# Altium project PowerBoard.PrjPcb (part 1 of 2)
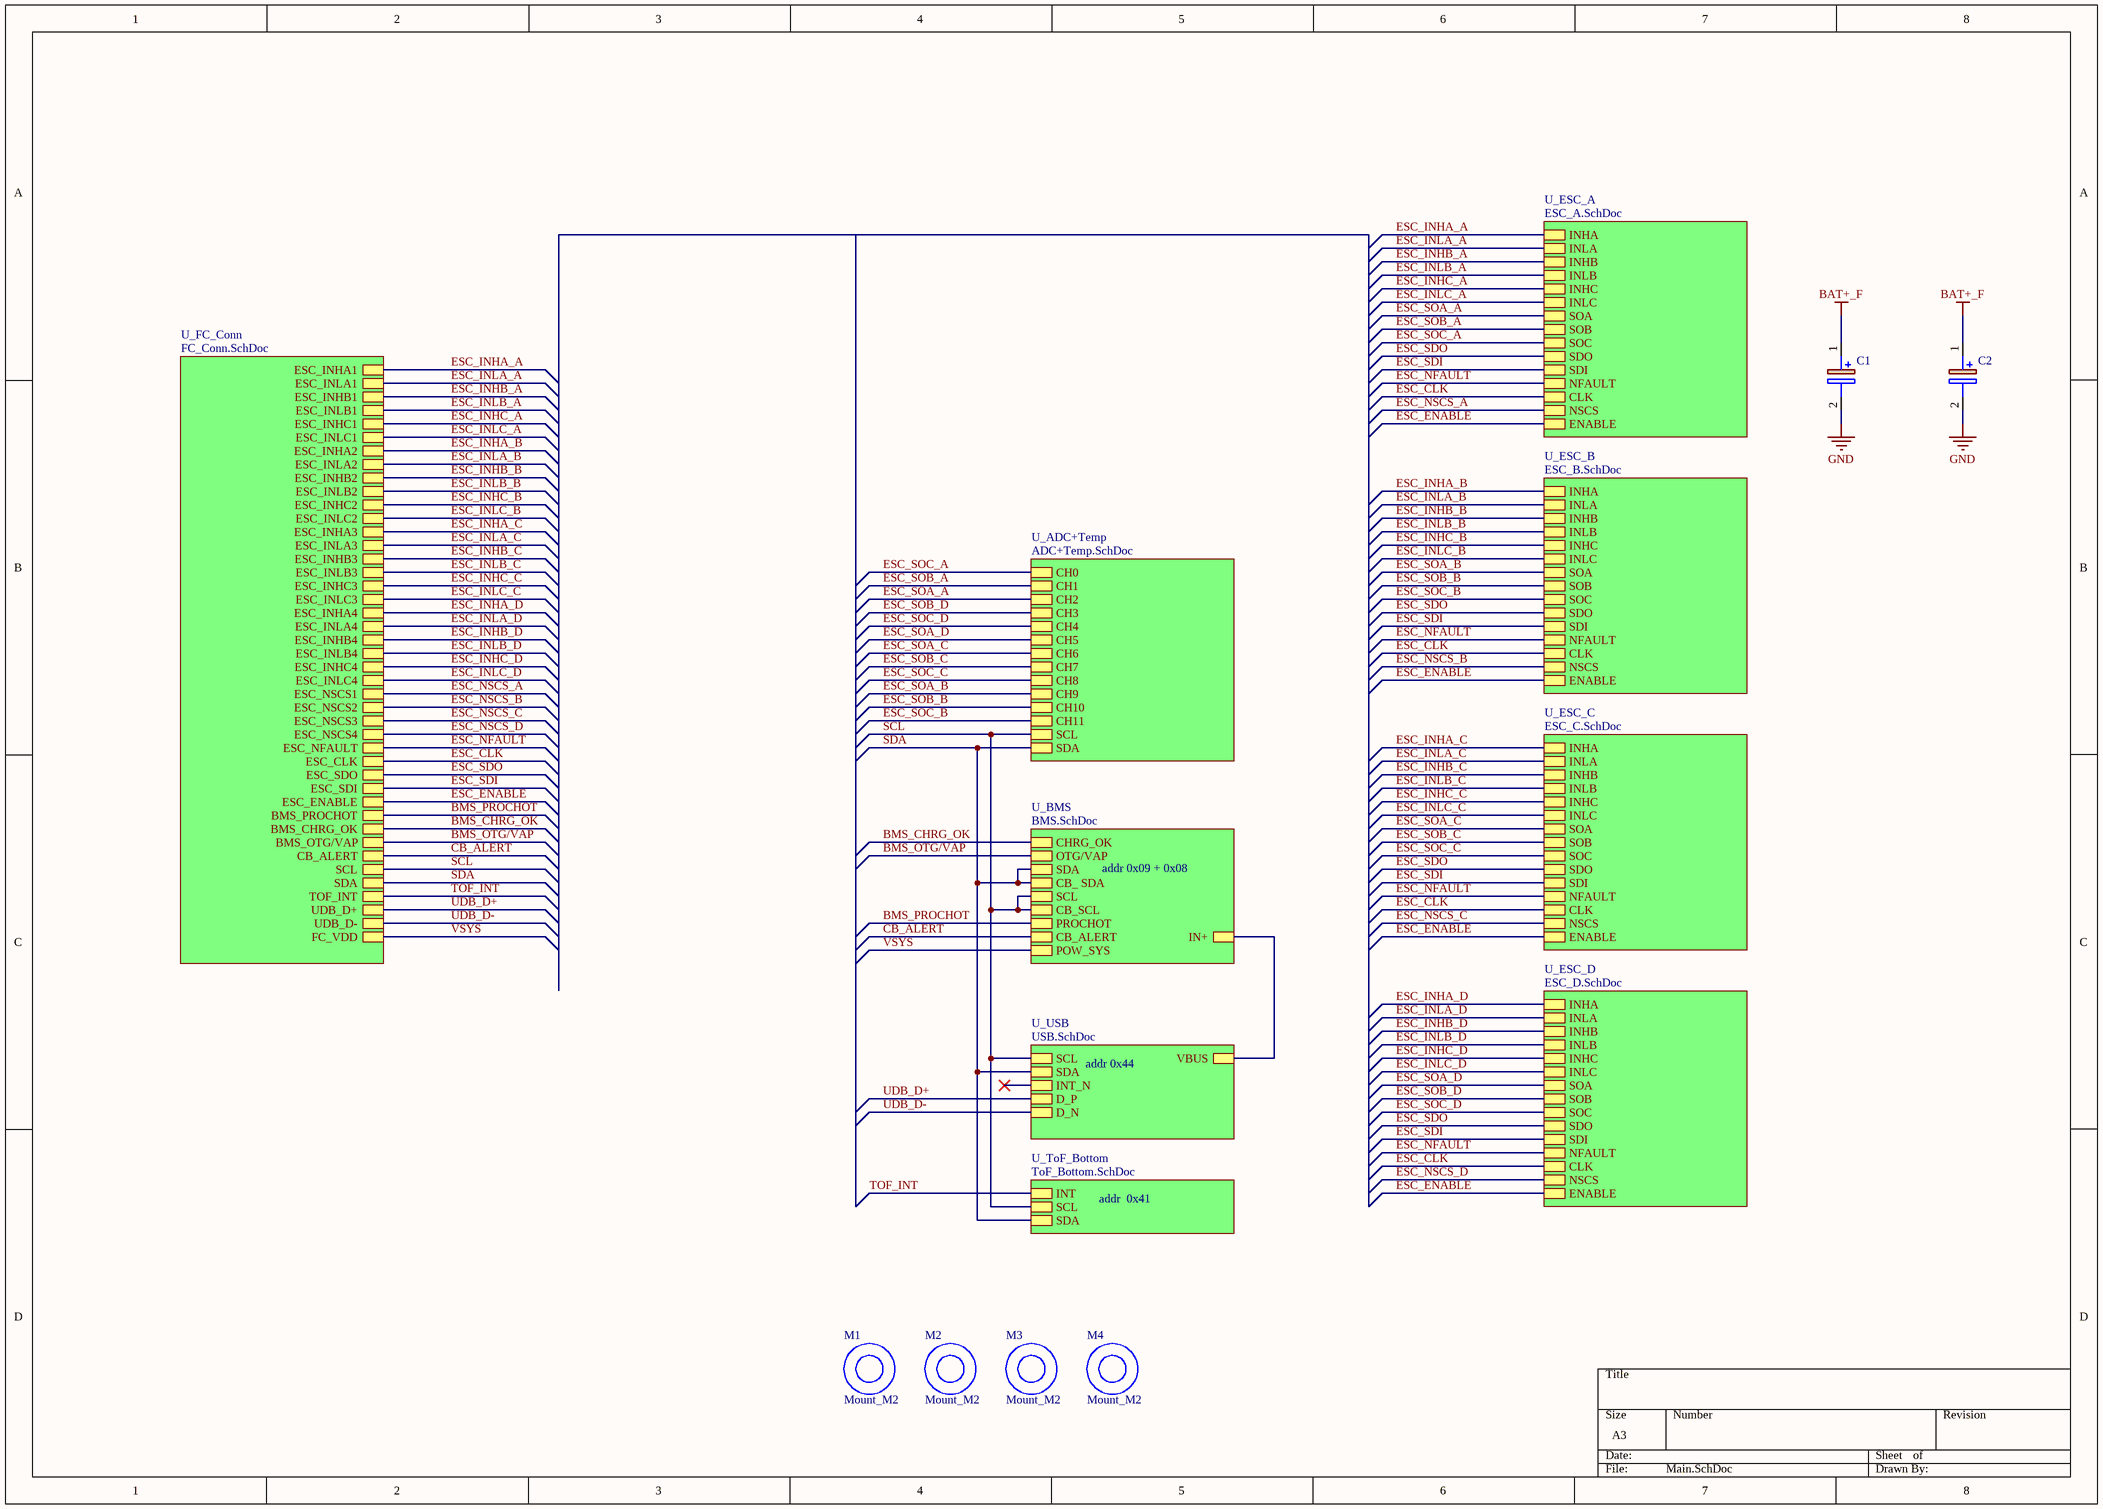
[diagram p0: Main.SchDoc]
10 sheets, 283 parts. Net scope: hierarchical (ports join the sheet entries above them; power ports are global).
Board file: PCB.PcbDoc
Sheets:
  Main.SchDoc
    U_BMS = BMS.SchDoc
    U_USB = USB.SchDoc
    U_ADC+Temp = ADC+Temp.SchDoc
    U_ToF_Bottom = ToF_Bottom.SchDoc
    U_FC_Conn = FC_Conn.SchDoc
    U_ESC_A = ESC_A.SchDoc
    U_ESC_B = ESC_B.SchDoc
    U_ESC_C = ESC_C.SchDoc
    U_ESC_D = ESC_D.SchDoc

## Sheet Main.SchDoc
size A3; SheetNumber: 1; SheetTotal: 10

### Parts
C1  EEH-ZL1V151XP  [EEEHP1H4R7P]  (value not drawn)
C2  EEH-ZL1V151XP  [EEEHP1H4R7P]  (value not drawn)
M1  Mount_M2  [Mount_M2_anti_vibration_rubber]
M2  Mount_M2  [Mount_M2_anti_vibration_rubber]
M3  Mount_M2  [Mount_M2_anti_vibration_rubber]
M4  Mount_M2  [Mount_M2_anti_vibration_rubber]

### Sub-sheets
U_ADC+Temp = ADC+Temp.SchDoc: SDA, SCL, CH0, CH1, CH2, CH3, CH4, CH5, CH6, CH7, CH8, CH9, CH10, CH11
U_BMS = BMS.SchDoc: CHRG_OK, OTG/VAP, SDA, SCL, PROCHOT, CB_SCL, CB_ SDA, CB_ALERT, POW_SYS, IN+
U_ESC_A = ESC_A.SchDoc: INHA, INLA, INHB, INLB, INHC, INLC, SOA, SOB, SOC, SDO, SDI, NFAULT, CLK, NSCS, ENABLE
U_ESC_B = ESC_B.SchDoc: INHA, INLA, INHB, INLB, INHC, INLC, SOA, SOB, SOC, SDO, SDI, NFAULT, CLK, NSCS, ENABLE
U_ESC_C = ESC_C.SchDoc: INHA, INLA, INHB, INLB, INHC, INLC, SOA, SOB, SOC, SDO, SDI, NFAULT, CLK, NSCS, ENABLE
U_ESC_D = ESC_D.SchDoc: INHA, INLA, INHB, INLB, INHC, INLC, SOA, SOB, SOC, SDO, SDI, NFAULT, CLK, NSCS, ENABLE
U_FC_Conn = FC_Conn.SchDoc: ESC_INLA1, ESC_INLB1, ESC_INLC1, ESC_INLA2, ESC_INLB2, ESC_INLC2, ESC_INLA3, ESC_INLB3, ESC_INLC3, ESC_INHA4, ESC_INLB4, ESC_INLC4, ESC_NSCS1, ESC_INHA1, ESC_INHB1, ESC_INHC1, ESC_INHA2, ESC_INHB2, ESC_INHC2, ESC_INHA3, ESC_INHB3, ESC_INHC3, ESC_INLA4, ESC_INHB4, ESC_INHC4, ESC_NSCS2, ESC_NSCS3, ESC_NSCS4, ESC_NFAULT, ESC_CLK, ESC_SDO, ESC_SDI, ESC_ENABLE, BMS_PROCHOT, BMS_CHRG_OK, BMS_OTG/VAP, CB_ALERT, SCL, SDA, TOF_INT, UDB_D+, UDB_D-, FC_VDD
U_ToF_Bottom = ToF_Bottom.SchDoc: INT, SCL, SDA
U_USB = USB.SchDoc: SCL, SDA, INT_N, D_P, D_N, VBUS

### Nets
BAT+_F: C1.1(+) C2.1(+)
GND: C1.2(-) C2.2(-)
BMS_CHRG_OK: sheet U_BMS/CHRG_OK, sheet U_FC_Conn/BMS_CHRG_OK
BMS_OTG/VAP: sheet U_BMS/OTG/VAP, sheet U_FC_Conn/BMS_OTG/VAP
BMS_PROCHOT: sheet U_BMS/PROCHOT, sheet U_FC_Conn/BMS_PROCHOT
CB_ALERT: sheet U_BMS/CB_ALERT, sheet U_FC_Conn/CB_ALERT
ESC_CLK: sheet U_FC_Conn/ESC_CLK, sheet U_ESC_A/CLK, sheet U_ESC_B/CLK, sheet U_ESC_C/CLK, sheet U_ESC_D/CLK
ESC_ENABLE: sheet U_FC_Conn/ESC_ENABLE, sheet U_ESC_A/ENABLE, sheet U_ESC_B/ENABLE, sheet U_ESC_C/ENABLE, sheet U_ESC_D/ENABLE
ESC_INHA_A: sheet U_FC_Conn/ESC_INHA1, sheet U_ESC_A/INHA
ESC_INHA_B: sheet U_FC_Conn/ESC_INHA2, sheet U_ESC_B/INHA
ESC_INHA_C: sheet U_FC_Conn/ESC_INHA3, sheet U_ESC_C/INHA
ESC_INHA_D: sheet U_FC_Conn/ESC_INHA4, sheet U_ESC_D/INHA
ESC_INHB_A: sheet U_FC_Conn/ESC_INHB1, sheet U_ESC_A/INHB
ESC_INHB_B: sheet U_FC_Conn/ESC_INHB2, sheet U_ESC_B/INHB
ESC_INHB_C: sheet U_FC_Conn/ESC_INHB3, sheet U_ESC_C/INHB
ESC_INHB_D: sheet U_FC_Conn/ESC_INHB4, sheet U_ESC_D/INHB
ESC_INHC_A: sheet U_FC_Conn/ESC_INHC1, sheet U_ESC_A/INHC
ESC_INHC_B: sheet U_FC_Conn/ESC_INHC2, sheet U_ESC_B/INHC
ESC_INHC_C: sheet U_FC_Conn/ESC_INHC3, sheet U_ESC_C/INHC
ESC_INHC_D: sheet U_FC_Conn/ESC_INHC4, sheet U_ESC_D/INHC
ESC_INLA_A: sheet U_FC_Conn/ESC_INLA1, sheet U_ESC_A/INLA
ESC_INLA_B: sheet U_FC_Conn/ESC_INLA2, sheet U_ESC_B/INLA
ESC_INLA_C: sheet U_FC_Conn/ESC_INLA3, sheet U_ESC_C/INLA
ESC_INLA_D: sheet U_FC_Conn/ESC_INLA4, sheet U_ESC_D/INLA
ESC_INLB_A: sheet U_FC_Conn/ESC_INLB1, sheet U_ESC_A/INLB
ESC_INLB_B: sheet U_FC_Conn/ESC_INLB2, sheet U_ESC_B/INLB
ESC_INLB_C: sheet U_FC_Conn/ESC_INLB3, sheet U_ESC_C/INLB
ESC_INLB_D: sheet U_FC_Conn/ESC_INLB4, sheet U_ESC_D/INLB
ESC_INLC_A: sheet U_FC_Conn/ESC_INLC1, sheet U_ESC_A/INLC
ESC_INLC_B: sheet U_FC_Conn/ESC_INLC2, sheet U_ESC_B/INLC
ESC_INLC_C: sheet U_FC_Conn/ESC_INLC3, sheet U_ESC_C/INLC
ESC_INLC_D: sheet U_FC_Conn/ESC_INLC4, sheet U_ESC_D/INLC
ESC_NFAULT: sheet U_FC_Conn/ESC_NFAULT, sheet U_ESC_A/NFAULT, sheet U_ESC_B/NFAULT, sheet U_ESC_C/NFAULT, sheet U_ESC_D/NFAULT
ESC_NSCS_A: sheet U_FC_Conn/ESC_NSCS1, sheet U_ESC_A/NSCS
ESC_NSCS_B: sheet U_FC_Conn/ESC_NSCS2, sheet U_ESC_B/NSCS
ESC_NSCS_C: sheet U_FC_Conn/ESC_NSCS3, sheet U_ESC_C/NSCS
ESC_NSCS_D: sheet U_FC_Conn/ESC_NSCS4, sheet U_ESC_D/NSCS
ESC_SDI: sheet U_FC_Conn/ESC_SDI, sheet U_ESC_A/SDI, sheet U_ESC_B/SDI, sheet U_ESC_C/SDI, sheet U_ESC_D/SDI
ESC_SDO: sheet U_FC_Conn/ESC_SDO, sheet U_ESC_A/SDO, sheet U_ESC_B/SDO, sheet U_ESC_C/SDO, sheet U_ESC_D/SDO
ESC_SOA_A: sheet U_ADC+Temp/CH2, sheet U_ESC_A/SOA
ESC_SOA_B: sheet U_ADC+Temp/CH9, sheet U_ESC_B/SOA
ESC_SOA_C: sheet U_ADC+Temp/CH6, sheet U_ESC_C/SOA
ESC_SOA_D: sheet U_ADC+Temp/CH5, sheet U_ESC_D/SOA
ESC_SOB_A: sheet U_ADC+Temp/CH1, sheet U_ESC_A/SOB
ESC_SOB_B: sheet U_ADC+Temp/CH10, sheet U_ESC_B/SOB
ESC_SOB_C: sheet U_ADC+Temp/CH7, sheet U_ESC_C/SOB
ESC_SOB_D: sheet U_ADC+Temp/CH3, sheet U_ESC_D/SOB
ESC_SOC_A: sheet U_ADC+Temp/CH0, sheet U_ESC_A/SOC
ESC_SOC_B: sheet U_ADC+Temp/CH11, sheet U_ESC_B/SOC
ESC_SOC_C: sheet U_ADC+Temp/CH8, sheet U_ESC_C/SOC
ESC_SOC_D: sheet U_ADC+Temp/CH4, sheet U_ESC_D/SOC
SCL: sheet U_BMS/SCL, sheet U_BMS/CB_SCL, sheet U_USB/SCL, sheet U_ADC+Temp/SCL, sheet U_ToF_Bottom/SCL, sheet U_FC_Conn/SCL
SDA: sheet U_BMS/SDA, sheet U_BMS/CB_ SDA, sheet U_USB/SDA, sheet U_ADC+Temp/SDA, sheet U_ToF_Bottom/SDA, sheet U_FC_Conn/SDA
TOF_INT: sheet U_ToF_Bottom/INT, sheet U_FC_Conn/TOF_INT
UDB_D+: sheet U_USB/D_P, sheet U_FC_Conn/UDB_D+  [project net D_P]
UDB_D-: sheet U_USB/D_N, sheet U_FC_Conn/UDB_D-  [project net D_N]
VBUS: sheet U_BMS/IN+, sheet U_USB/VBUS
VSYS: sheet U_BMS/POW_SYS, sheet U_FC_Conn/FC_VDD

### Notes on the sheet
- addr 0x09 + 0x08
- addr 0x44
- addr  0x41

### Library data of the parts
C1 C2 = EEH-ZL1V151XP: Capacitor Polarised; Manufacturer_Name: Panasonic; Datasheet Link: https://industrial.panasonic.com/cdbs/www-data/pdf/RDD0000/ast-ind-303928.pdf; Manufacturer_Part_Number: EEH-ZL1V151XP

## Sheet BMS.SchDoc
size A2; SheetNumber: 3; SheetTotal: 10
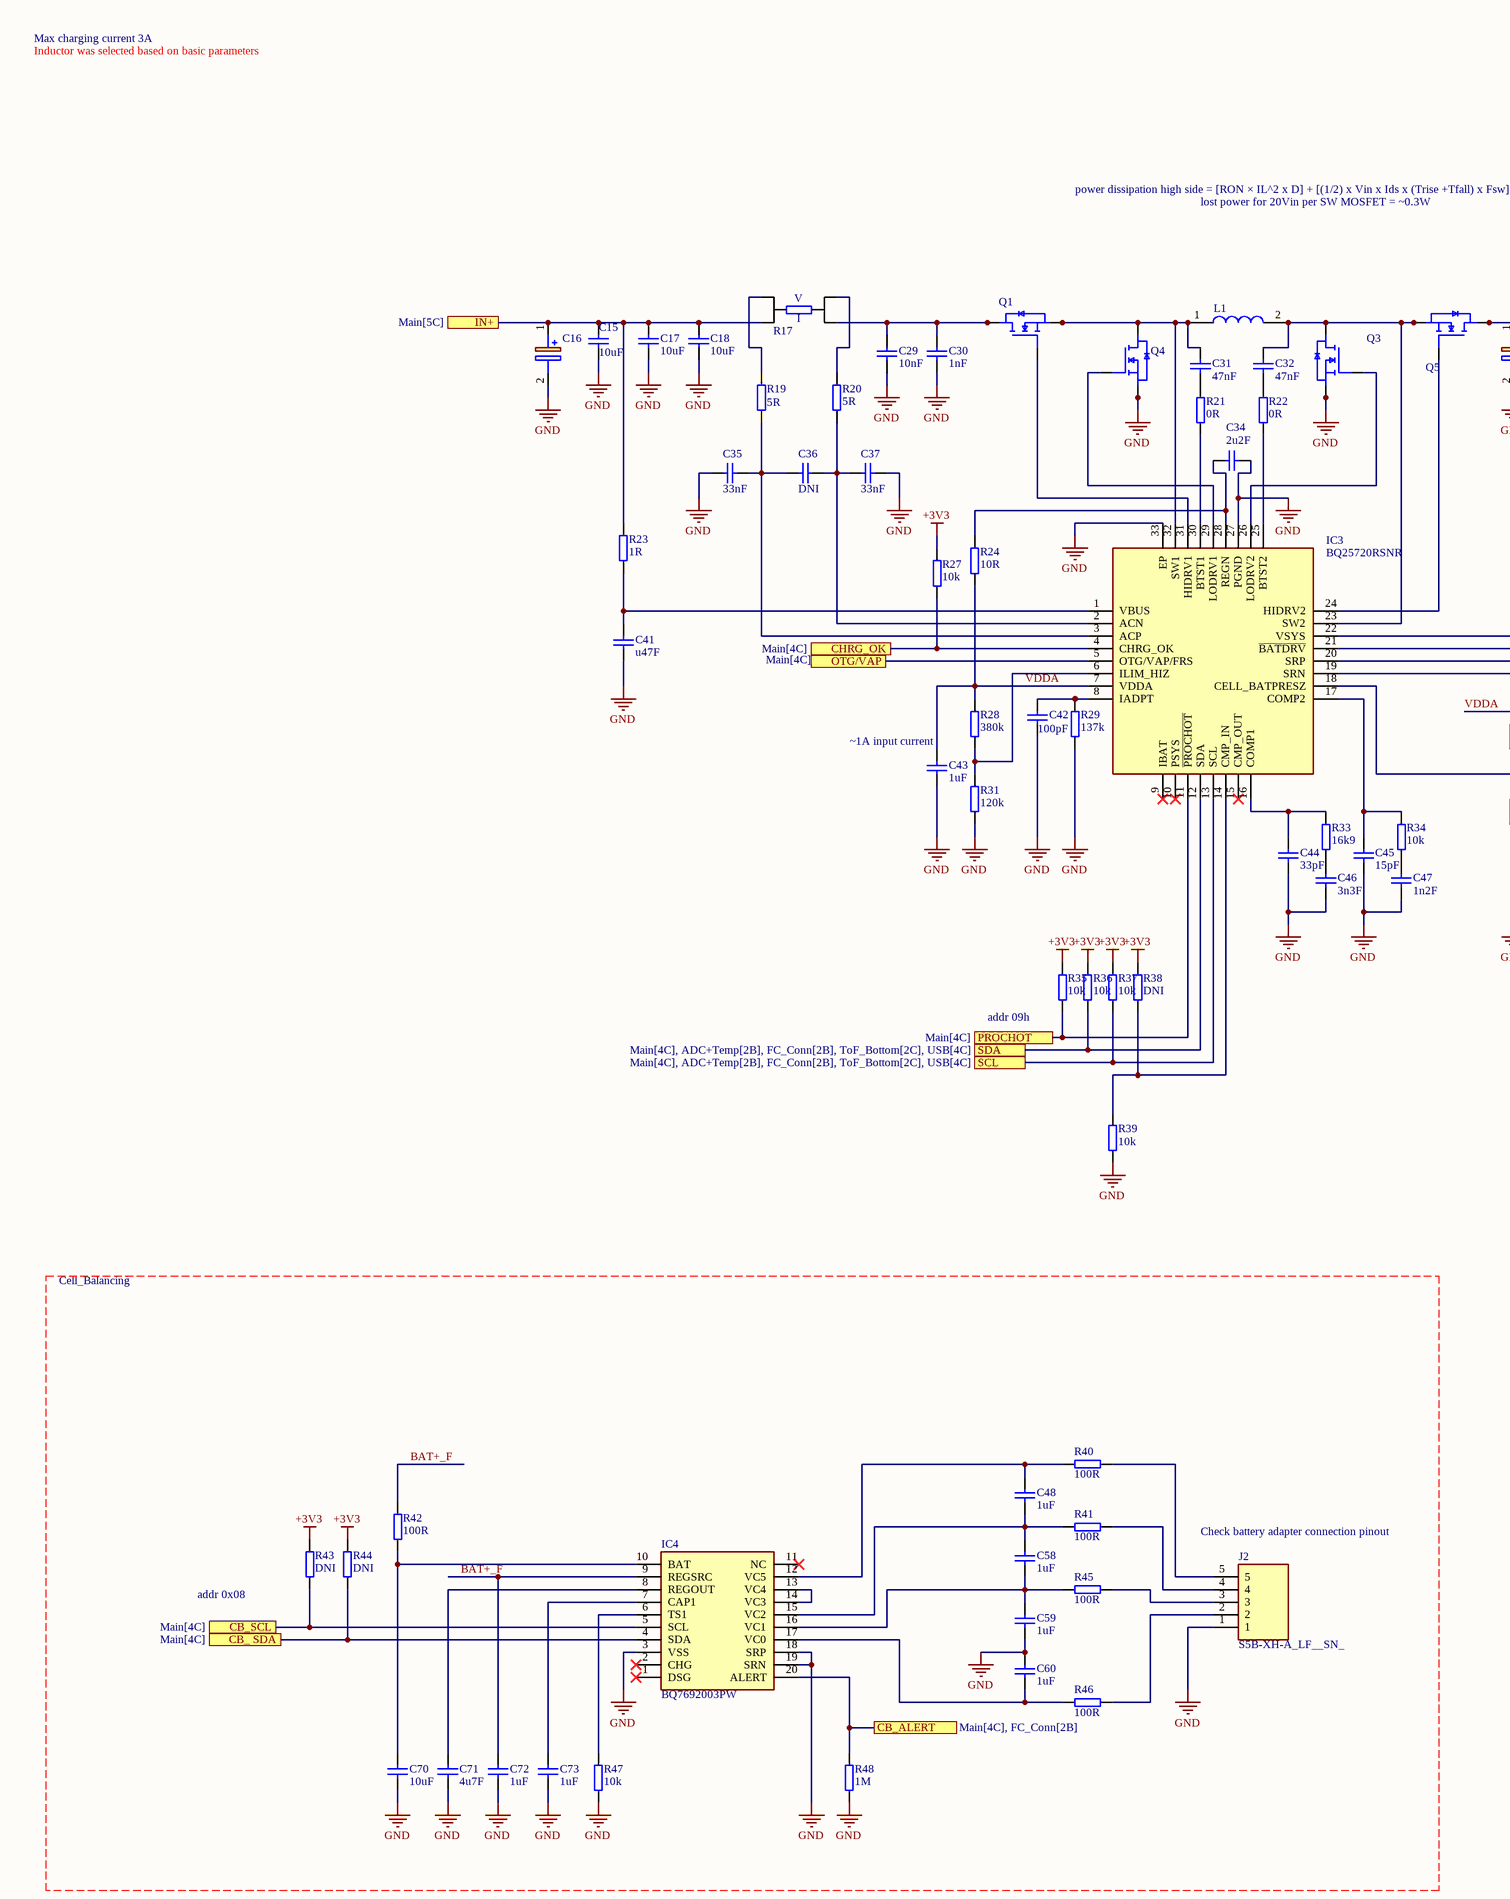
[diagram p1: BMS.SchDoc, left]
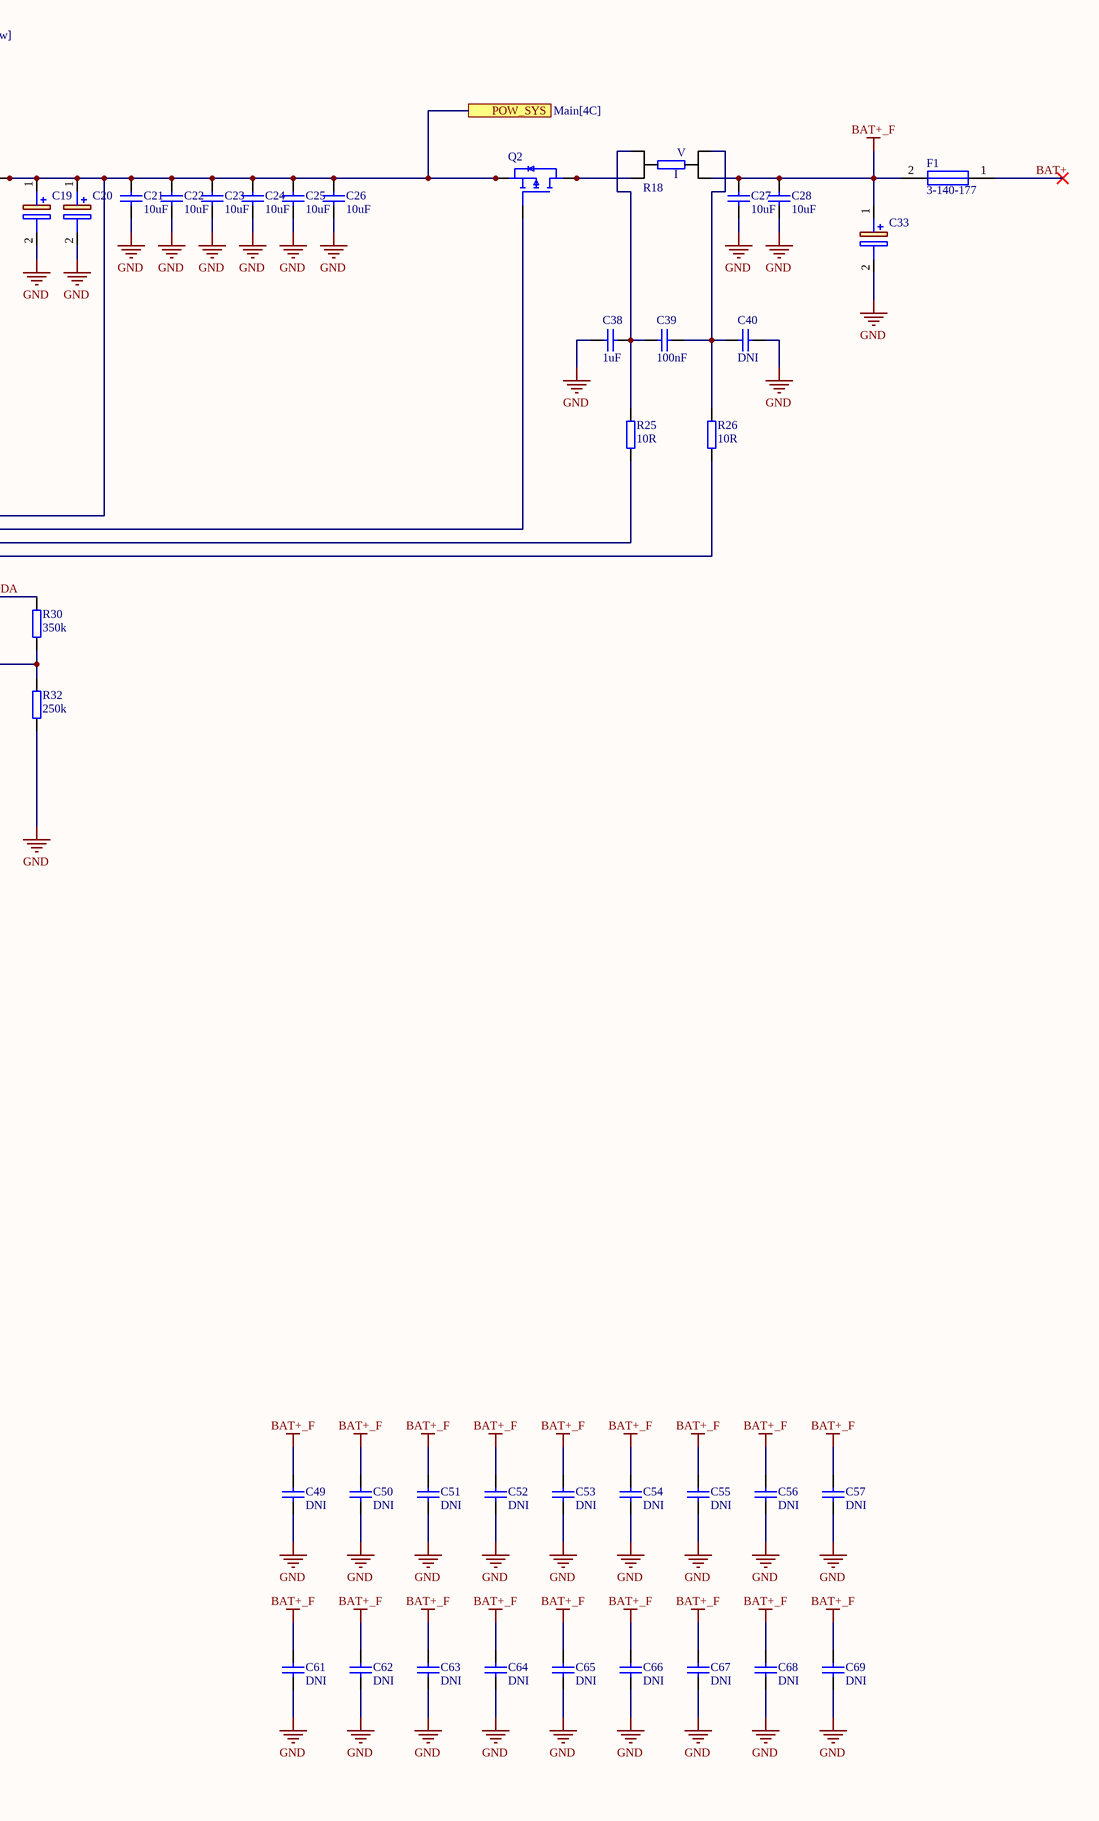
[diagram p2: BMS.SchDoc, right]

### Parts
C15  value 10uF  [CAP0603]  (hidden comment: Cap0603)
C16  TR3D336K025D0200  [CAPPM7343X310N]  (value not drawn)
C17  value 10uF  [CAP0805]  (hidden comment: Cap0805)
C18  value 10uF  [CAP0805]  (hidden comment: Cap0805)
C19  293D226X0025D2TE3  [CAPPM7343X310N]  (value not drawn)
C20  293D226X0025D2TE3  [CAPPM7343X310N]  (value not drawn)
C21  value 10uF  [CAP0805]  (hidden comment: Cap0805)
C22  value 10uF  [CAP0805]  (hidden comment: Cap0805)
C23  value 10uF  [CAP0805]  (hidden comment: Cap0805)
C24  value 10uF  [CAP0805]  (hidden comment: Cap0805)
C25  value 10uF  [CAP0805]  (hidden comment: Cap0805)
C26  value 10uF  [CAP0805]  (hidden comment: Cap0805)
C27  value 10uF  [CAP0805]  (hidden comment: Cap0805)
C28  value 10uF  [CAP0805]  (hidden comment: Cap0805)
C29  value 10nF  [CAP0402]  (hidden comment: Cap0402)
C30  value 1nF  [CAP0402]  (hidden comment: Cap0402)
C31  value 47nF  [CAP0402]  (hidden comment: Cap0402)
C32  value 47nF  [CAP0402]  (hidden comment: Cap0402)
C33  EEH-ZL1V151XP  [EEEHP1H4R7P]  (value not drawn)
C34  value 2u2F  [CAP0402]  (hidden comment: Cap0402)
C35  value 33nF  [CAP0402]  (hidden comment: Cap0402)
C36  value DNI  [CAP0402]  (hidden comment: Cap0402)
C37  value 33nF  [CAP0402]  (hidden comment: Cap0402)
C38  value 1uF  [CAP0402]  (hidden comment: Cap0402)
C39  value 100nF  [CAP0402]  (hidden comment: Cap0402)
C40  value DNI  [CAP0402]  (hidden comment: Cap0402)
C41  value u47F  [CAP0603]  (hidden comment: Cap0603)
C42  value 100pF  [CAP0402]  (hidden comment: Cap0402)
C43  value 1uF  [CAP0402]  (hidden comment: Cap0402)
C44  value 33pF  [CAP0402]  (hidden comment: Cap0402)
C45  value 15pF  [CAP0402]  (hidden comment: Cap0402)
C46  value 3n3F  [CAP0402]  (hidden comment: Cap0402)
C47  value 1n2F  [CAP0402]  (hidden comment: Cap0402)
C48  value 1uF  [CAP0402]  (hidden comment: Cap0402)
C49  value DNI  [CAP0805]  (hidden comment: Cap0805)
C50  value DNI  [CAP0805]  (hidden comment: Cap0805)
C51  value DNI  [CAP0805]  (hidden comment: Cap0805)
C52  value DNI  [CAP0805]  (hidden comment: Cap0805)
C53  value DNI  [CAP0805]  (hidden comment: Cap0805)
C54  value DNI  [CAP0805]  (hidden comment: Cap0805)
C55  value DNI  [CAP0805]  (hidden comment: Cap0805)
C56  value DNI  [CAP0805]  (hidden comment: Cap0805)
C57  value DNI  [CAP0805]  (hidden comment: Cap0805)
C58  value 1uF  [CAP0402]  (hidden comment: Cap0402)
C59  value 1uF  [CAP0402]  (hidden comment: Cap0402)
C60  value 1uF  [CAP0402]  (hidden comment: Cap0402)
C61  value DNI  [CAP0805]  (hidden comment: Cap0805)
C62  value DNI  [CAP0805]  (hidden comment: Cap0805)
C63  value DNI  [CAP0805]  (hidden comment: Cap0805)
C64  value DNI  [CAP0805]  (hidden comment: Cap0805)
C65  value DNI  [CAP0805]  (hidden comment: Cap0805)
C66  value DNI  [CAP0805]  (hidden comment: Cap0805)
C67  value DNI  [CAP0805]  (hidden comment: Cap0805)
C68  value DNI  [CAP0805]  (hidden comment: Cap0805)
C69  value DNI  [CAP0805]  (hidden comment: Cap0805)
C70  value 10uF  [CAP0805]  (hidden comment: Cap0805)
C71  value 4u7F  [CAP0805]  (hidden comment: Cap0402)
C72  value 1uF  [CAP0402]  (hidden comment: Cap0402)
C73  value 1uF  [CAP0402]  (hidden comment: Cap0402)
F1  3-140-177  [3140177]
IC3  BQ25720RSNR  [QFN40P400X400X80-33N-D]
IC4  BQ7692003PW  [SOP65P640X120-20N]
J2  S5B-XH-A_LF__SN_  [SHDRRA5W64P0X250_1X5_1490X1150X610P]
L1  XEL4020-222MEC  [XEL4020222MEC]  (value not drawn)
Q1  PMPB07R3ENAX  [DMT3006LFDF7]  (value not drawn)
Q2  SISA01DN-T1-GE3  [SIS862DNT1GE3]  (value not drawn)
Q3  PMPB07R3ENAX  [DMT3006LFDF7]  (value not drawn)
Q4  PMPB07R3ENAX  [DMT3006LFDF7]  (value not drawn)
Q5  PMPB07R3ENAX  [DMT3006LFDF7]  (value not drawn)
R17  L4CA0612LR010FNR  [L4CA0612L0M50FNR]  (value not drawn)
R18  L4CA0612LR010FNR  [L4CA0612L0M50FNR]  (value not drawn)
R19  value 5R  [RES0402]  (hidden comment: Res0402)
R20  value 5R  [RES0402]  (hidden comment: Res0402)
R21  value 0R  [RES0402]  (hidden comment: Res0402)
R22  value 0R  [RES0402]  (hidden comment: Res0402)
R23  value 1R  [RES0603]  (hidden comment: Res0603)
R24  value 10R  [RES0402]  (hidden comment: Res0402)
R25  value 10R  [RES0402]  (hidden comment: Res0402)
R26  value 10R  [RES0402]  (hidden comment: Res0402)
R27  value 10k  [RES0402]  (hidden comment: Res0402)
R28  value 380k  [RES0402]  (hidden comment: Res0402)
R29  value 137k  [RES0402]  (hidden comment: Res0402)
R30  value 350k  [RES0402]  (hidden comment: Res0402)
R31  value 120k  [RES0402]  (hidden comment: Res0402)
R32  value 250k  [RES0402]  (hidden comment: Res0402)
R33  value 16k9  [RES0402]  (hidden comment: Res0402)
R34  value 10k  [RES0402]  (hidden comment: Res0402)
R35  value 10k  [RES0402]  (hidden comment: Res0402)
R36  value 10k  [RES0402]  (hidden comment: Res0402)
R37  value 10k  [RES0402]  (hidden comment: Res0402)
R38  value DNI  [RES0402]  (hidden comment: Res0402)
R39  value 10k  [RES0402]  (hidden comment: Res0402)
R40  value 100R  [RES0805]  (hidden comment: Res0805)
R41  value 100R  [RES0805]  (hidden comment: Res0805)
R42  value 100R  [RES0402]  (hidden comment: Res0805)
R43  value DNI  [RES0402]  (hidden comment: Res0402)
R44  value DNI  [RES0402]  (hidden comment: Res0402)
R45  value 100R  [RES0805]  (hidden comment: Res0805)
R46  value 100R  [RES0805]  (hidden comment: Res0805)
R47  value 10k  [RES0402]  (hidden comment: Res0402)
R48  value 1M  [RES0402]  (hidden comment: Res0402)

### Ports
CB_ SDA (see Main[4C]), CB_ALERT (see Main[4C], FC_Conn[2B]), CB_SCL (see Main[4C]), CHRG_OK (see Main[4C]), IN+ (see Main[5C]), OTG/VAP (see Main[4C]), POW_SYS (see Main[4C]), PROCHOT (see Main[4C]), SCL (see Main[4C], ADC+Temp[2B], FC_Conn[2B], ToF_Bottom[2C], USB[4C]), SDA (see Main[4C], ADC+Temp[2B], FC_Conn[2B], ToF_Bottom[2C], USB[4C])

### Nets
+3V3: R27.2 R35.2 R36.2 R37.2 R38.2 R43.2 R44.2
BAT+_F: C27.2 C28.2 C33.1(+) C49.2 C50.2 C51.2 C52.2 C53.2 C54.2 C55.2 C56.2 C57.2 C61.2 C62.2 C63.2 C64.2 C65.2 C66.2 C67.2 C68.2 C69.2 C72.2 F1.2 IC4.9(REGSRC) R18.2 R42.2
GND: C15.1 C16.2(-) C17.1 C18.1 C19.2(-) C20.2(-) C21.1 C22.1 C23.1 C24.1 C25.1 C26.1 C27.1 C28.1 C29.1 C30.1 C33.2(-) C34.1 C35.1 C37.2 C38.1 C40.2 C41.1 C42.1 C43.1 C44.1 C45.1 C46.1 C47.1 C49.1 C50.1 C51.1 C52.1 C53.1 C54.1 C55.1 C56.1 C57.1 C59.1 C60.2 C61.1 C62.1 C63.1 C64.1 C65.1 C66.1 C67.1 C68.1 C69.1 C70.1 C71.1 C72.1 C73.1 IC3.27(PGND) IC3.33(EP) IC4.3(VSS) IC4.18(SRP) IC4.19(SRN) J2.1 Q3.4(S_1) Q3.8(S_2) Q4.4(S_1) Q4.8(S_2) R29.1 R31.1 R32.1 R39.1 R47.1 R48.1
BAT+: F1.1
BMS_CHRG_OK: IC3.4(CHRG_OK) R27.1 ; port CHRG_OK
BMS_OTG/VAP: IC3.5(OTG/VAP/FRS) ; port OTG/VAP
BMS_PROCHOT: IC3.11(~{PROCHOT}) R35.1 ; port PROCHOT
CB_ALERT: IC4.20(ALERT) R48.2 ; port CB_ALERT
SCL: IC3.13(SCL) IC4.5(SCL) R37.1 R43.1 ; port SCL, port CB_SCL
SDA: IC3.12(SDA) IC4.4(SDA) R36.1 R44.1 ; port SDA, port CB_ SDA
VBUS: C15.2 C16.1(+) C17.2 C18.2 R17.2 R23.2 ; port IN+
VDDA: C43.2 IC3.7(VDDA) R24.2 R28.2 R30.2
VSYS: C19.1(+) C20.1(+) C21.2 C22.2 C23.2 C24.2 C25.2 C26.2 IC3.22(VSYS) Q2.1(S_1) Q2.2(S_2) Q2.3(S_3) Q5.1(D_1) Q5.2(D_2) Q5.5(D_3) Q5.6(D_4) Q5.7(D_5) ; port POW_SYS
NetC29_2: C29.2 C30.2 Q1.1(D_1) Q1.2(D_2) Q1.5(D_3) Q1.6(D_4) Q1.7(D_5) R17.3
NetC31_1: C31.1 R21.2
NetC31_2: C31.2 IC3.32(SW1) L1.1 Q1.4(S_1) Q1.8(S_2) Q4.1(D_1) Q4.2(D_2) Q4.5(D_3) Q4.6(D_4) Q4.7(D_5)
NetC32_1: C32.1 R22.2
NetC32_2: C32.2 IC3.23(SW2) L1.2 Q3.1(D_1) Q3.2(D_2) Q3.5(D_3) Q3.6(D_4) Q3.7(D_5) Q5.4(S_1) Q5.8(S_2)
NetC34_2: C34.2 IC3.28(REGN) R24.1
NetC35_2: C35.2 C36.1 IC3.3(ACP) R19.1
NetC36_2: C36.2 C37.1 IC3.2(ACN) R20.1
NetC38_2: C38.2 C39.1 R18.4 R25.2
NetC39_2: C39.2 C40.1 R18.1 R26.2
NetC41_2: C41.2 IC3.1(VBUS) R23.1
NetC42_2: C42.2 IC3.8(IADPT) R29.2
NetC44_2: C44.2 IC3.16(COMP1) R33.2
NetC45_2: C45.2 IC3.17(COMP2) R34.2
NetC46_2: C46.2 R33.1
NetC47_2: C47.2 R34.1
NetC48_1: C48.1 C58.2 IC4.15(VC2) R41.1
NetC48_2: C48.2 IC4.12(VC5) R40.1
NetC58_1: C58.1 C59.2 IC4.16(VC1) R45.1
NetC60_1: C60.1 IC4.17(VC0) R46.1
NetC70_2: C70.2 IC4.10(BAT) R42.1
NetC71_2: C71.2 IC4.8(REGOUT)
NetC73_2: C73.2 IC4.7(CAP1)
NetIC3_6: IC3.6(ILIM_HIZ) R28.1 R31.2
NetIC3_14: IC3.14(CMP_IN) R38.1 R39.2
NetIC3_18: IC3.18(CELL_BATPRESZ) R30.1 R32.2
NetIC3_19: IC3.19(SRN) R26.1
NetIC3_20: IC3.20(SRP) R25.1
NetIC3_21: IC3.21(~{BATDRV}) Q2.4(G)
NetIC3_24: IC3.24(HIDRV2) Q5.3(G)
NetIC3_25: IC3.25(BTST2) R22.1
NetIC3_26: IC3.26(LODRV2) Q3.3(G)
NetIC3_29: IC3.29(LODRV1) Q4.3(G)
NetIC3_30: IC3.30(BTST1) R21.1
NetIC3_31: IC3.31(HIDRV1) Q1.3(G)
NetIC4_6: IC4.6(TS1) R47.2
NetIC4_13: IC4.13(VC4) IC4.14(VC3)
NetJ2_2: J2.2 R46.2
NetJ2_3: J2.3 R45.2
NetJ2_4: J2.4 R41.2
NetJ2_5: J2.5 R40.2
NetQ2_5: Q2.5(D_1) Q2.6(D_2) Q2.7(D_3) Q2.8(D_4) Q2.9(D_4) R18.3
NetR17_1: R17.1 R19.2
NetR17_4: R17.4 R20.2

Not connected (* = marked no-connect by the designer): IC3 9(IBAT)* 10(PSYS)* 15(CMP_OUT)*; IC4 1(DSG)* 2(CHG)* 11(NC)*

### Notes on the sheet
- Max charging current 3A
- Inductor was selected based on basic parameters
- power dissipation high side = [RON × IL^2 x D] + [(1/2) x Vin x Ids x (Trise +Tfall) x Fsw]
- lost power for 20Vin per SW MOSFET = ~0.3W
- (near C43) ~1A input current
- (near R35) addr 09h
- Cell_Balancing
- (near J2) Check battery adapter connection pinout
- addr 0x08
- (in symbol L4CA0612LR010FNR) V; I

### Library data of the parts
C15 = Cap0603: Manufacturer_Part_Number: GRM188R61E106MA73J; Voltage: 25V
C16 = TR3D336K025D0200: Capacitor Polarised; Manufacturer_Name: Vishay; Value: 33uF; Datasheet Link: http://www.vishay.com/doc?40080; Height: 3.1mm; Manufacturer_Part_Number: TR3D336K025D0200; Mouser Part Number: 74-TR3D336K025D0200; Mouser Price/Stock: https://www.mouser.com/Search/Refine.aspx?Keyword=74-TR3D336K025D0200
C17 C18 C21-C28 = Cap0805: Manufacturer_Part_Number: GRM21BR61H106KE43K; Voltage: 50V
C19 C20 = 293D226X0025D2TE3: Capacitor Polarised; Manufacturer_Name: Vishay; Value: 22uF; Datasheet Link: http://www.vishay.com/docs/40002/293d.pdf; Height: 3.1mm; Manufacturer_Part_Number: 293D226X0025D2TE3; Mouser Part Number: 74-293D226X0025D2TE3; Mouser Price/Stock: https://www.mouser.co.uk/ProductDetail/Vishay-Sprague/293D226X0025D2TE3?qs=27QRfRkF2isTHSjSebANCw%3D%3D
C29 = Cap0402: Manufacturer_Part_Number: GRM155R71H103MA88D; Voltage: 50V
C30 = Cap0402: Manufacturer_Part_Number: GRM155R71H102KA01J; Voltage: 50V
C31 C32 = Cap0402: Manufacturer_Part_Number: GRM155R61H473KE14D; Voltage: 50V
C33 = EEH-ZL1V151XP: as C1 on sheet Main; Datasheet Link: https://industrial.panasonic.com/cdbs/www-data/pdf/RDD0000/ast-ind-303928.pdf; Manufacturer_Part_Number: EEH-ZL1V151XP
C34 = Cap0402: Manufacturer_Part_Number: GRM155R6YA225KE11J; Voltage: 25V
C35 C37 = Cap0402: Manufacturer_Part_Number: GRM155R61H333KE14D; Voltage: 6V3
C38 C43 C48 C58-C60 C72 C73 = Cap0402: Manufacturer_Part_Number: GRM155R61H105KE05J; Voltage: 50V
C39 = Cap0402: Manufacturer_Part_Number: GRM155R71H104ME14D; Voltage: 50V
C41 = Cap0603: Manufacturer_Part_Number: GRM188R61H474KA12D; Voltage: 25V
C42 = Cap0402: Manufacturer_Part_Number: C0402C101K5RACAUTO; Voltage: 50V
C44 = Cap0402: Manufacturer_Part_Number: 04025C330JAT2A; Voltage: 25V
C45 = Cap0402: Manufacturer_Part_Number: C0402C150K5RACAUTO; Voltage: 25V
C46 = Cap0402: Manufacturer_Part_Number: GRM155R71H332KA01D; Voltage: 25V
C47 = Cap0402: Manufacturer_Part_Number: GCM155R71H122KA37D; Voltage: 25V
C70 = Cap0805: Voltage: 50V
C71 = Cap0402: Manufacturer_Part_Number: CM05X5R475M25AH; Voltage: 50V
F1 = 3-140-177: Fuse; Manufacturer_Name: SCHURTER; Datasheet Link: https://www.schurter.com/en/datasheet/typ_UHS.pdf; Height: 4.85mm; Manufacturer_Part_Number: 3-140-177; Mouser Part Number: 693-3-140-177; Mouser Price/Stock: https://www.mouser.co.uk/ProductDetail/Schurter/3-140-177?qs=3Rah4i%252BhyCHL3c0yS6dOkg%3D%3D; Arrow Part Number: 3-140-177; Arrow Price/Stock: https://www.arrow.com/en/products/3-140-177/schurter?region=europe
IC3 = BQ25720RSNR: Integrated Circuit; Manufacturer_Name: Texas Instruments; Datasheet Link: https://www.ti.com/lit/ds/symlink/bq25720.pdf?ts=1649085131820&ref_url=https%253A%252F%252Fwww.ti.com%252Fproduct%252FBQ25720; Height: 0.8mm; Manufacturer_Part_Number: BQ25720RSNR; Mouser Part Number: 595-BQ25720RSNR; Mouser Price/Stock: https://www.mouser.co.uk/ProductDetail/Texas-Instruments/BQ25720RSNR?qs=ljCeji4nMDlwF8f%2Foae7aQ%3D%3D
IC4 = BQ7692003PW: Integrated Circuit; Manufacturer_Name: Texas Instruments; Datasheet Link: http://www.ti.com/lit/gpn/BQ76920; Height: 1.2mm; Manufacturer_Part_Number: BQ7692003PW; Mouser Part Number: 595-BQ7692003PW; Mouser Price/Stock: https://www.mouser.co.uk/ProductDetail/Texas-Instruments/BQ7692003PW?qs=%2Fd%252BFzHvH4c0Hx6X3GvdboA%3D%3D; Arrow Part Number: BQ7692003PW; Arrow Price/Stock: https://www.arrow.com/en/products/bq7692003pw/texas-instruments?utm_currency=USD&region=nac
J2 = S5B-XH-A_LF__SN_: Connector; Manufacturer_Name: JST (JAPAN SOLDERLESS TERMINALS); Manufacturer_Part_Number: S5B-XH-A(LF)(SN); Datasheet Link: http://www.jst-mfg.com/product/pdf/eng/eXH.pdf; Height: 6.1mm; Mouser Part Number: 306-S5B-XH-ALFSN; Mouser Price/Stock: https://www.mouser.co.uk/ProductDetail/JST-Commercial/S5B-XH-ALFSN?qs=QpmGXVUTftFJm7Okp%252B2lFg%3D%3D; Arrow Part Number: S5B-XH-A(LF)(SN); Arrow Price/Stock: https://www.arrow.com/en/products/s5b-xh-a-lf-sn/jst-manufacturing?utm_currency=USD&region=europe
L1 = XEL4020-222MEC: Inductor; Manufacturer_Name: COILCRAFT; Height: 2.1mm; Manufacturer_Part_Number: XEL4020-222MEC; Mouser Part Number: 994-XEL4020-222MEC; Mouser Price/Stock: https://www.mouser.co.uk/ProductDetail/Coilcraft/XEL4020-222MEC?qs=chTDxNqvsynf4rqMeCpizg%3D%3D
Q1 Q3-Q5 = DMT3006LFDF-7: MOSFET (N-Channel); Manufacturer_Name: Diodes Incorporated; Datasheet Link: https://www.arrow.com/en/products/dmt3006lfdf-7/diodes-incorporated; Height: 0.63mm; Manufacturer_Part_Number: DMT3006LFDF-7; Mouser Part Number: 621-DMT3006LFDF-7; Mouser Price/Stock: https://www.mouser.co.uk/ProductDetail/Diodes-Incorporated/DMT3006LFDF-7?qs=4EhzHfbM1GhGS5nn3gf3wg%3D%3D; Arrow Part Number: DMT3006LFDF-7; Arrow Price/Stock: https://www.arrow.com/en/products/dmt3006lfdf-7/diodes-incorporated
Q2 = SISA01DN-T1-GE3: MOSFET (P-Channel); Manufacturer_Name: Vishay; Datasheet Link: https://www.vishay.com/docs/76198/sisa01dn.pdf; Manufacturer_Part_Number: SISA01DN-T1-GE3; Mouser Part Number: 78-SISA01DN-T1-GE3; Mouser Price/Stock: https://www.mouser.co.uk/ProductDetail/Vishay-Semiconductors/SISA01DN-T1-GE3?qs=chTDxNqvsymq6IcOj9ze4g%3D%3D; Arrow Part Number: SISA01DN-T1-GE3; Arrow Price/Stock: https://www.arrow.com/en/products/sisa01dn-t1-ge3/vishay?region=nac
R17 R18 = L4CA0612LR010FNR: Resistor; Manufacturer_Name: LITTELFUSE; Datasheet Link: https://www.littelfuse.com/media?resourcetype=datasheets&itemid=db674d7b-aa25-4173-816a-92297475a59f&filename=littelfuse-resistor-l4ca-c-datasheet; Height: 0.7mm; Manufacturer_Part_Number: L4CA0612LR010FNR
R19 R20 = Res0402: Manufacturer_Part_Number: RT0402FRE075R1L
R21 R22 = Res0402: Manufacturer_Part_Number: RCA04020000ZSED
R23 = Res0603: Manufacturer_Part_Number: MCT06030C1008FP500
R24-R26 = Res0402: Manufacturer_Part_Number: AA0402JR-0710RL
R27 R34-R37 R39 R47 = Res0402: Manufacturer_Part_Number: ERA-2AED103X
R28 = Res0402: Manufacturer_Part_Number: RC0402FR-07383KL
R29 = Res0402: Manufacturer_Part_Number: CRCW0402137KFKED
R30 = Res0402: Manufacturer_Part_Number: CRCW0402348KFKEDC
R31 = Res0402: Manufacturer_Part_Number: AF0402FR-07120KL
R32 = Res0402: Manufacturer_Part_Number: CRCW0402249KFKEDC
R33 = Res0402: Manufacturer_Part_Number: ERA-2AEB1692X
R40 R41 R45 R46 = Res0805: Manufacturer_Part_Number: CMP0805-FX-1000ELF
R48 = Res0402: Manufacturer_Part_Number: RK73H1ETTP1004F
C36 C40 = Cap0402: Voltage: DNI
C49-C57 C61-C69 = Cap0805: Voltage: DNI

## Sheet USB.SchDoc
size A4; SheetNumber: 4; SheetTotal: 10
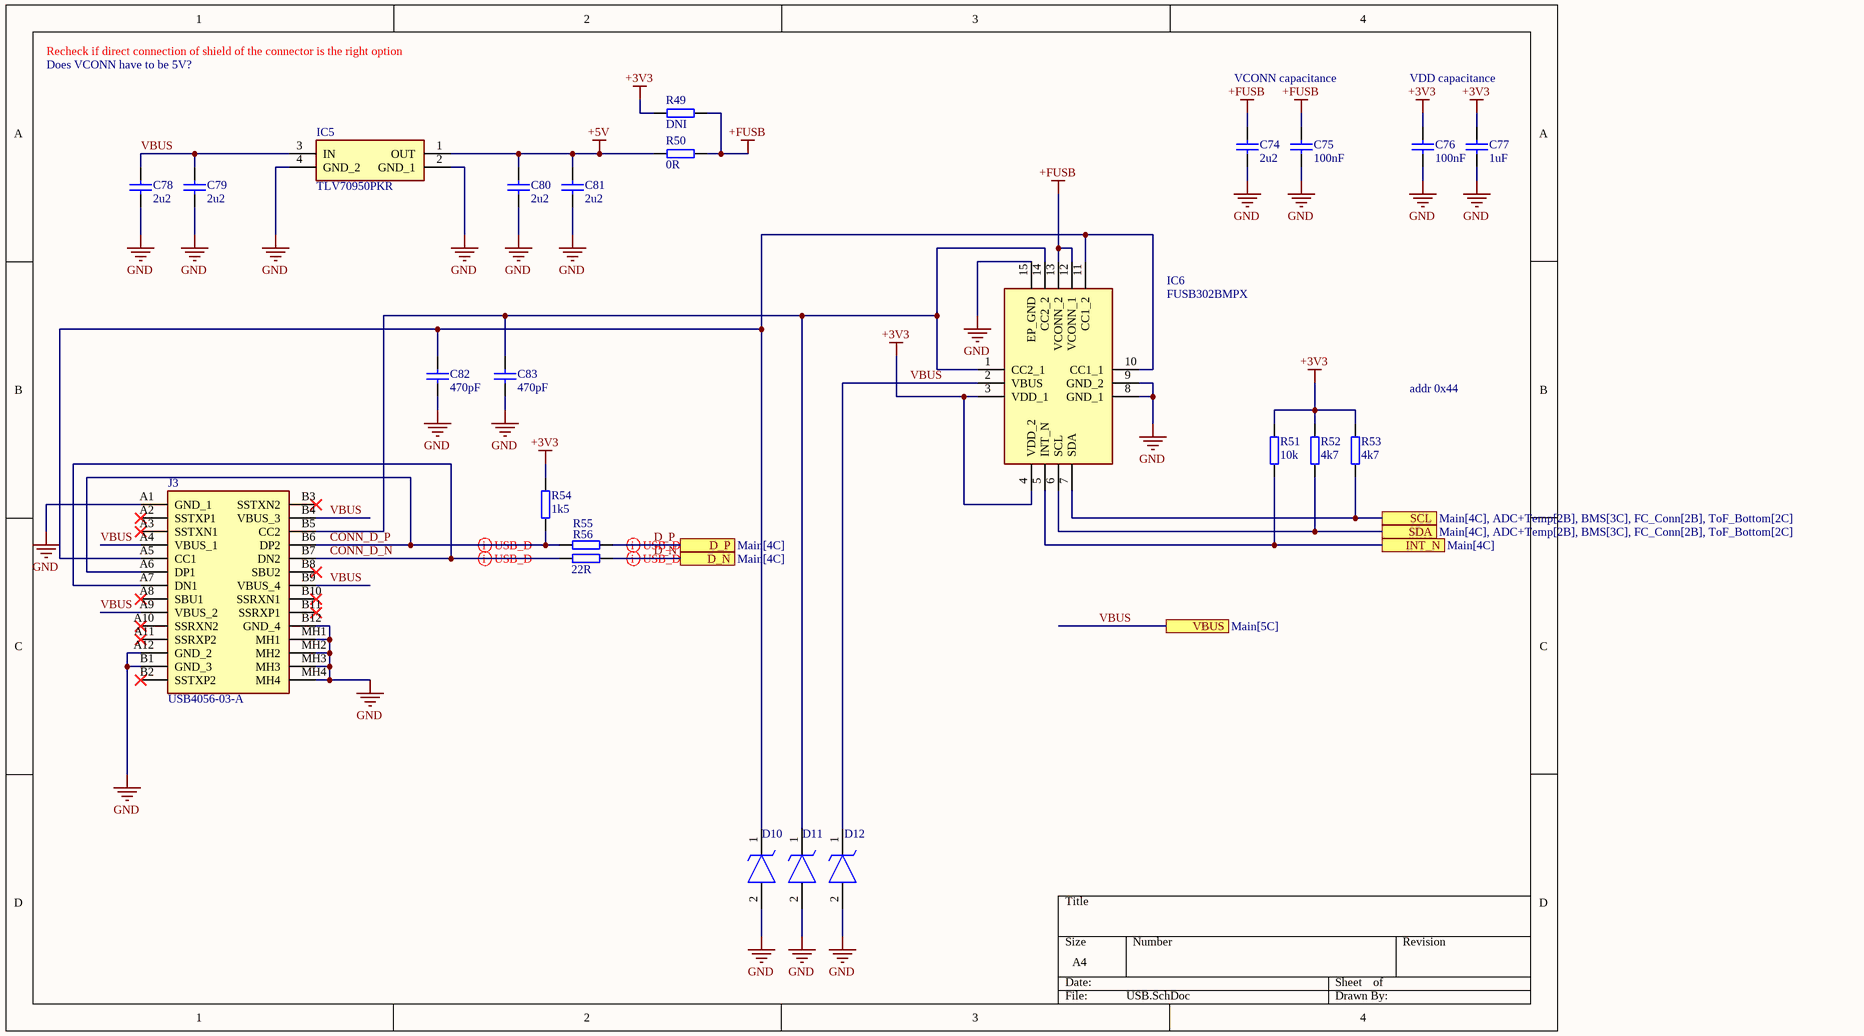
[diagram p3: USB.SchDoc]

### Parts
C74  value 2u2  [CAP0603]  (hidden comment: Cap0603)
C75  value 100nF  [CAP0402]  (hidden comment: Cap0402)
C76  value 100nF  [CAP0402]  (hidden comment: Cap0402)
C77  value 1uF  [CAP0402]  (hidden comment: Cap0402)
C78  value 2u2  [CAP0603]  (hidden comment: Cap0603)
C79  value 2u2  [CAP0603]  (hidden comment: Cap0603)
C80  value 2u2  [CAP0603]  (hidden comment: Cap0603)
C81  value 2u2  [CAP0603]  (hidden comment: Cap0603)
C82  value 470pF  [CAP0402]  (hidden comment: Cap0402)
C83  value 470pF  [CAP0402]  (hidden comment: Cap0402)
D10  D1213A-01LP4-7B  [D1213A01LP47B]  (value not drawn)
D11  D1213A-01LP4-7B  [D1213A01LP47B]  (value not drawn)
D12  DF2S24FS,L3M  [SODFL1006X45N]  (value not drawn)
IC5  TLV70950PKR  [TL431AQPKG3]
IC6  FUSB302BMPX  [QFN50P250X250X80-15N]
J3  USB4056-03-A  [USB405603A]
R49  value DNI  [RES0402]  (hidden comment: Res0402)
R50  value 0R  [RES0402]  (hidden comment: Res0402)
R51  value 10k  [RES0402]  (hidden comment: Res0402)
R52  value 4k7  [RES0402]  (hidden comment: Res0402)
R53  value 4k7  [RES0402]  (hidden comment: Res0402)
R54  value 1k5  [RES0402]  (hidden comment: Res0402)
R55  Res0402  [RES0402]  (value not drawn)
R56  value 22R  [RES0402]  (hidden comment: Res0402)

### Ports
D_N (see Main[4C]), D_P (see Main[4C]), INT_N (see Main[4C]), SCL (see Main[4C], ADC+Temp[2B], BMS[3C], FC_Conn[2B], ToF_Bottom[2C]), SDA (see Main[4C], ADC+Temp[2B], BMS[3C], FC_Conn[2B], ToF_Bottom[2C]), VBUS (see Main[5C])

### Nets
+3V3: C76.2 C77.2 IC6.3(VDD_1) IC6.4(VDD_2) R49.2 R51.2 R52.2 R53.2 R54.2
+5V: C80.2 C81.2 IC5.1(OUT) R50.2
+FUSB: C74.2 C75.2 IC6.12(VCONN_1) IC6.13(VCONN_2) R49.1 R50.1
GND: C74.1 C75.1 C76.1 C77.1 C78.1 C79.1 C80.1 C81.1 C82.1 C83.1 D10.2(A) D11.2(A) D12.2(A) IC5.2(GND_1) IC5.4(GND_2) IC6.8(GND_1) IC6.9(GND_2) IC6.15(EP_GND) J3.A1(GND_1) J3.A12(GND_2) J3.B1(GND_3) J3.B12(GND_4) J3.MH1 J3.MH2 J3.MH3 J3.MH4
CONN_D_N: J3.A7(DN1) J3.B7(DN2) R56.1
CONN_D_P: J3.A6(DP1) J3.B6(DP2) R54.1 R55.1
D_N: R56.2 ; port D_N
D_P: R55.2 ; port D_P
SCL: IC6.7(SDA) R53.1 ; port SCL
SDA: IC6.6(SCL) R52.1 ; port SDA
VBUS: C78.2 C79.2 D12.1(K) IC5.3(IN) IC6.2(VBUS) J3.A4(VBUS_1) J3.A9(VBUS_2) J3.B4(VBUS_3) J3.B9(VBUS_4) ; port VBUS
NetC82_2: C82.2 D10.1(K) IC6.10(CC1_1) IC6.11(CC1_2) J3.A5(CC1)
NetC83_2: C83.2 D11.1(K) IC6.1(CC2_1) IC6.14(CC2_2) J3.B5(CC2)
NetIC6_5: IC6.5(INT_N) R51.1 ; port INT_N

Not connected (* = marked no-connect by the designer): J3 A2(SSTXP1)* A3(SSTXN1)* A8(SBU1)* A10(SSRXN2)* A11(SSRXP2)* B2(SSTXP2)* B3(SSTXN2)* B8(SBU2)* B10(SSRXN1)* B11(SSRXP1)*

### Layout directives
differential pair: CONN_D_N, CONN_D_P, D_N, D_P

### Notes on the sheet
- Recheck if direct connection of shield of the connector is the right option
- Does VCONN have to be 5V?
- VCONN capacitance
- VDD capacitance
- addr 0x44

### Library data of the parts
C74 C78-C81 = Cap0603: Manufacturer_Part_Number: GRT188R61H225KE13D; Voltage: 50V
C75 C76 = Cap0402: as C39 on sheet BMS
C77 = Cap0402: as C38 on sheet BMS
C82 C83 = Cap0402: Manufacturer_Part_Number: GCM155R71H471MA37D; Voltage: 50V
D10 D11 = D1213A-01LP4-7B: TVS Diode (Uni-directional); Manufacturer_Name: Diodes Incorporated; Datasheet Link: https://www.diodes.com/assets/Datasheets/D1213A-01LP4.pdf; Height: 0.4mm; Manufacturer_Part_Number: D1213A-01LP4-7B; Mouser Part Number: 621-D1213A-01LP4-7B; Mouser Price/Stock: https://www.mouser.co.uk/ProductDetail/Diodes-Incorporated/D1213A-01LP4-7B?qs=gfe7vQ8txpVKfG5NOSOvfA%3D%3D; Arrow Part Number: D1213A-01LP4-7B; Arrow Price/Stock: https://www.arrow.com/en/products/d1213a-01lp4-7b/diodes-incorporated?region=europe
D12 = DF2S24FS,L3M: TVS Diode (Uni-directional); Manufacturer_Name: Toshiba; Datasheet Link: https://www.mouser.com/datasheet/2/408/DF2S24FS_datasheet_en_20140718-708374.pdf; Height: 0.45mm; Manufacturer_Part_Number: DF2S24FS,L3M; Mouser Part Number: 757-DF2S24FSL3M; Mouser Price/Stock: https://www.mouser.co.uk/ProductDetail/Toshiba/DF2S24FSL3M?qs=lhkzy8lC%252BSvG2umxl0FuEw%3D%3D; Arrow Part Number: DF2S24FS,L3M; Arrow Price/Stock: https://www.arrow.com/en/products/df2s24fsl3m/toshiba?region=nac
IC5 = TLV70950PKR: Integrated Circuit; Manufacturer_Name: Texas Instruments; Datasheet Link: https://www.ti.com/lit/gpn/tlv709; Height: 1.6mm; Manufacturer_Part_Number: TLV70950PKR; Mouser Part Number: 595-TLV70950PKR; Mouser Price/Stock: https://www.mouser.co.uk/ProductDetail/Texas-Instruments/TLV70950PKR?qs=dbcCsuKDzFU3yYGsVf2izQ%3D%3D; Arrow Part Number: TLV70950PKR; Arrow Price/Stock: null?region=nac
IC6 = FUSB302BMPX: Integrated Circuit; Manufacturer_Name: onsemi; Datasheet Link: https://www.onsemi.com/pub/Collateral/FUSB302B-D.PDF; Height: 0.8mm; Manufacturer_Part_Number: FUSB302BMPX; Mouser Part Number: 512-FUSB302BMPX; Mouser Price/Stock: https://www.mouser.co.uk/ProductDetail/onsemi-Fairchild/FUSB302BMPX?qs=8ziscO3x5y1SHqdwooDK6g%3D%3D; Arrow Part Number: FUSB302BMPX; Arrow Price/Stock: https://www.arrow.com/en/products/fusb302bmpx/on-semiconductor?utm_currency=USD&region=nac
J3 = USB4056-03-A: Connector; Manufacturer_Name: GCT (GLOBAL CONNECTOR TECHNOLOGY); Datasheet Link: https://www.mouser.jp/datasheet/2/837/usb4056-2448808.pdf; Height: 3.56mm; Manufacturer_Part_Number: USB4056-03-A; Mouser Part Number: 640-USB4056-03-A; Mouser Price/Stock: https://www.mouser.co.uk/ProductDetail/GCT/USB4056-03-A?qs=QNEnbhJQKvbZ7hZzgFEugA%3D%3D
R50 = Res0402: as R21 on sheet BMS
R51 = Res0402: Manufacturer_Part_Number: ERA-2AED103X
R52 R53 = Res0402: Manufacturer_Part_Number: RC0402JR-7W4K7L
R54 = Res0402: Manufacturer_Part_Number: ERA-2AEB152X
R55 = Res0402: Manufacturer_Part_Number: MCS04020C2209FE000; Value: 22R
R56 = Res0402: Manufacturer_Part_Number: MCS04020C2209FE000

## Sheet ADC+Temp.SchDoc
size A3; SheetNumber: 5; SheetTotal: 10
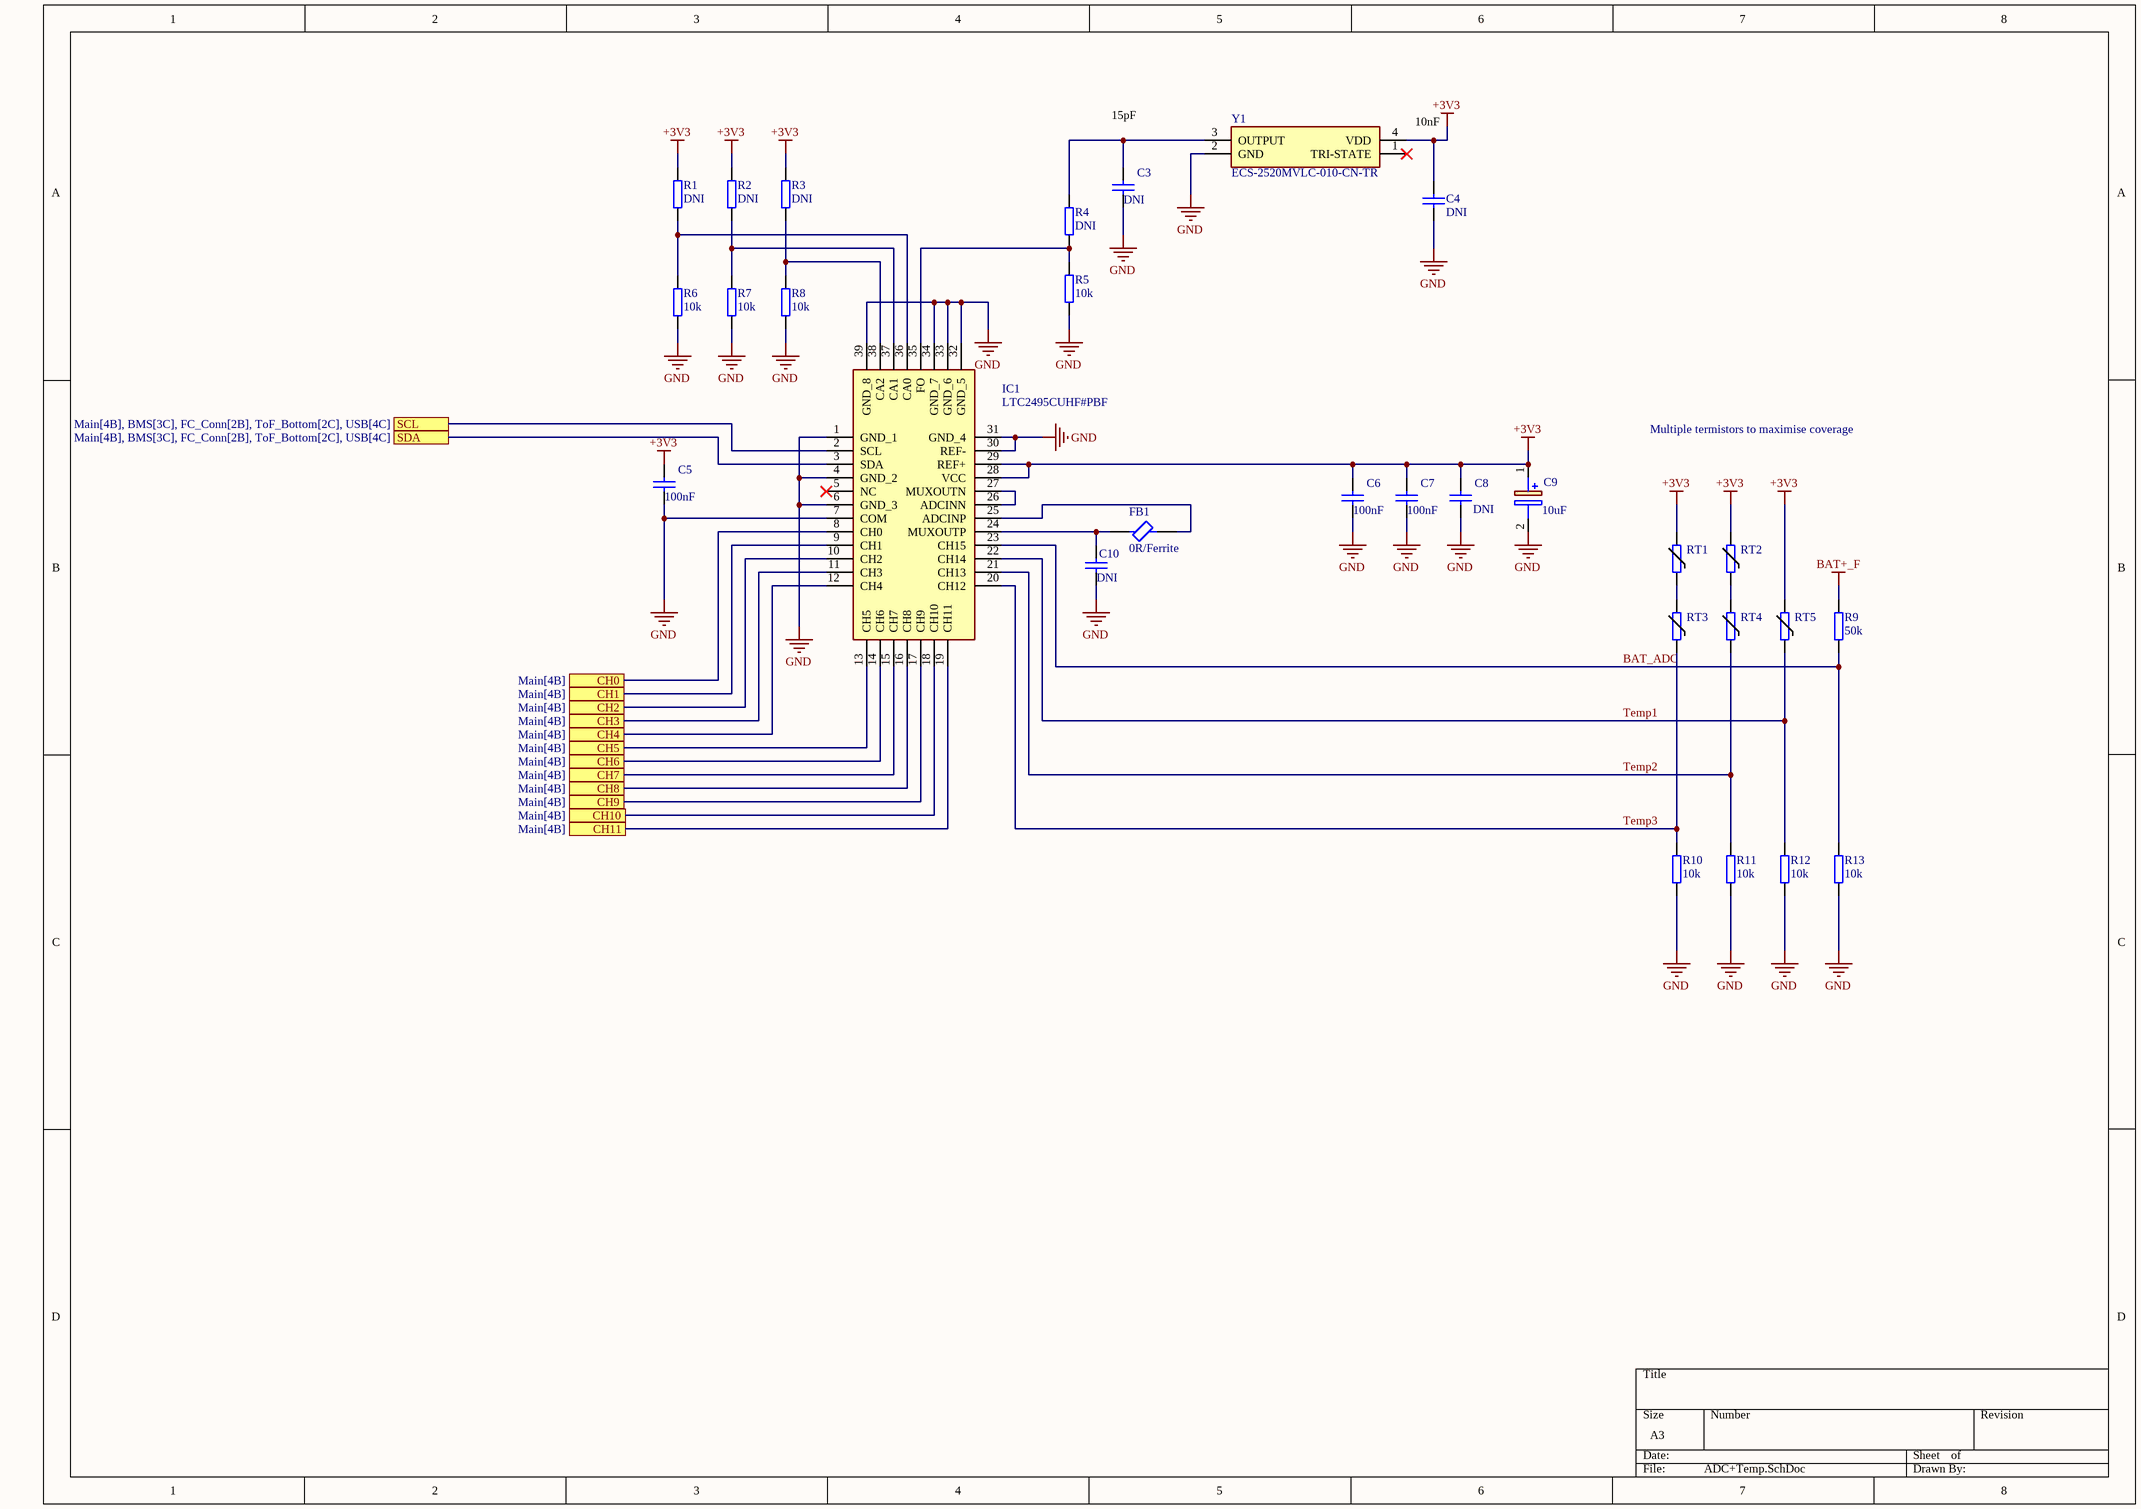
[diagram p4: ADC+Temp.SchDoc]

### Parts
C3  value DNI  [CAP0402]  (hidden comment: Cap0402)
C4  value DNI  [CAP0402]  (hidden comment: Cap0402)
C5  value 100nF  [CAP0402]  (hidden comment: Cap0402)
C6  value 100nF  [CAP0402]  (hidden comment: Cap0402)
C7  value 100nF  [CAP0402]  (hidden comment: Cap0402)
C8  value DNI  [CAP0603]  (hidden comment: Cap0603)
C9  value 10uF  [CAPPC1608X90N]  (hidden comment: TMCJ0J106MTRF)
C10  value DNI  [CAP0402]  (hidden comment: Cap0402)
FB1  0R/Ferrite  [NFZ15SG152SN10B]
IC1  LTC2495CUHF#PBF  [QFN50P500X700X80-39N-D]
R1  value DNI  [RES0402]  (hidden comment: Res0402)
R2  value DNI  [RES0402]  (hidden comment: Res0402)
R3  value DNI  [RES0402]  (hidden comment: Res0402)
R4  value DNI  [RES0402]  (hidden comment: Res0402)
R5  value 10k  [RES0402]  (hidden comment: Res0402)
R6  value 10k  [RES0402]  (hidden comment: Res0402)
R7  value 10k  [RES0402]  (hidden comment: Res0402)
R8  value 10k  [RES0402]  (hidden comment: Res0402)
R9  value 50k  [RES0402]  (hidden comment: Res0402)
R10  value 10k  [RES0402]  (hidden comment: Res0402)
R11  value 10k  [RES0402]  (hidden comment: Res0402)
R12  value 10k  [RES0402]  (hidden comment: Res0402)
R13  value 10k  [RES0402]  (hidden comment: Res0402)
RT1  TMP6131DECR  [TMP6131DECR]  (value not drawn)
RT2  TMP6131DECR  [TMP6131DECR]  (value not drawn)
RT3  TMP6131DECR  [TMP6131DECR]  (value not drawn)
RT4  TMP6131DECR  [TMP6131DECR]  (value not drawn)
RT5  TMP6131DECR  [TMP6131DECR]  (value not drawn)
Y1  ECS-2520MVLC-010-CN-TR  [ECS2520MVLC010CNTR]

### Ports
CH0 (see Main[4B]), CH1 (see Main[4B]), CH2 (see Main[4B]), CH3 (see Main[4B]), CH4 (see Main[4B]), CH5 (see Main[4B]), CH6 (see Main[4B]), CH7 (see Main[4B]), CH8 (see Main[4B]), CH9 (see Main[4B]), CH10 (see Main[4B]), CH11 (see Main[4B]), SCL (see Main[4B], BMS[3C], FC_Conn[2B], ToF_Bottom[2C], USB[4C]), SDA (see Main[4B], BMS[3C], FC_Conn[2B], ToF_Bottom[2C], USB[4C])

### Nets
+3V3: C4.2 C5.2 C6.2 C7.2 C8.2 C9.1(+) IC1.28(VCC) IC1.29(REF+) R1.2 R2.2 R3.2 RT1.2 RT2.2 RT5.2 Y1.4(VDD)
BAT+_F: R9.2
GND: C3.1 C4.1 C5.1 C6.1 C7.1 C8.1 C9.2(-) C10.1 IC1.1(GND_1) IC1.4(GND_2) IC1.6(GND_3) IC1.7(COM) IC1.30(REF-) IC1.31(GND_4) IC1.32(GND_5) IC1.33(GND_6) IC1.34(GND_7) IC1.39(GND_8) R5.1 R6.1 R7.1 R8.1 R10.1 R11.1 R12.1 R13.1 Y1.2(GND)
BAT_ADC: IC1.23(CH15) R9.1 R13.2
ESC_SOA_A: IC1.10(CH2) ; port CH2
ESC_SOA_B: IC1.17(CH9) ; port CH9
ESC_SOA_C: IC1.14(CH6) ; port CH6
ESC_SOA_D: IC1.13(CH5) ; port CH5
ESC_SOB_A: IC1.9(CH1) ; port CH1
ESC_SOB_B: IC1.18(CH10) ; port CH10
ESC_SOB_C: IC1.15(CH7) ; port CH7
ESC_SOB_D: IC1.11(CH3) ; port CH3
ESC_SOC_A: IC1.8(CH0) ; port CH0
ESC_SOC_B: IC1.19(CH11) ; port CH11
ESC_SOC_C: IC1.16(CH8) ; port CH8
ESC_SOC_D: IC1.12(CH4) ; port CH4
SCL: IC1.2(SCL) ; port SCL
SDA: IC1.3(SDA) ; port SDA
Temp1: IC1.22(CH14) R12.2 RT5.1
Temp2: IC1.21(CH13) R11.2 RT4.1
Temp3: IC1.20(CH12) R10.2 RT3.1
NetC3_2: C3.2 R4.2 Y1.3(OUTPUT)
NetC10_2: C10.2 FB1.1 IC1.24(MUXOUTP)
NetFB1_2: FB1.2 IC1.25(ADCINP)
NetIC1_26: IC1.26(ADCINN) IC1.27(MUXOUTN)
NetIC1_35: IC1.35(FO) R4.1 R5.2
NetIC1_36: IC1.36(CA0) R1.1 R6.2
NetIC1_37: IC1.37(CA1) R2.1 R7.2
NetIC1_38: IC1.38(CA2) R3.1 R8.2
NetRT1_1: RT1.1 RT3.2
NetRT2_1: RT2.1 RT4.2

Not connected (* = marked no-connect by the designer): IC1 5(NC)*; Y1 1(TRI-STATE)*

### Notes on the sheet
- 15pF
- (near Y1) 10nF
- Multiple termistors to maximise coverage

### Library data of the parts
C5-C7 = Cap0402: as C39 on sheet BMS
C9 = 298D106X96R3M2T: Capacitor Polarised; Voltage: 6V3; Manufacturer_Part_Number: TMCJ0J106MTRF
FB1 = BLM15PE471SH1D: Ferrite Bead; Manufacturer_Name: Murata Electronics; Datasheet Link: https://www.murata.com/en-global/products/productdetail.aspx?cate=luNoiseSupprFilteChipFerriBead&partno=BLM15PE471SH1%23; Height: 0.55mm; Manufacturer_Part_Number: BLM15PE471SH1D; Mouser Part Number: 81-BLM15PE471SH1D; Mouser Price/Stock: https://www.mouser.co.uk/ProductDetail/Murata-Electronics/BLM15PE471SH1D?qs=DRkmTr78QATAY5qAVx1hGA%3D%3D
IC1 = LTC2495CUHF#PBF: Integrated Circuit; Manufacturer_Name: Analog Devices; Datasheet Link: https://www.analog.com/media/en/technical-documentation/data-sheets/2495fe.pdf; Height: 0.8mm; Manufacturer_Part_Number: LTC2495CUHF#PBF; Mouser Part Number: 584-LTC2495CUHF#PBF; Mouser Price/Stock: https://www.mouser.co.uk/ProductDetail/Analog-Devices/LTC2495CUHFPBF?qs=hVkxg5c3xu%252Bd9nHQ1gaMcw%3D%3D; Arrow Part Number: LTC2495CUHF#PBF; Arrow Price/Stock: https://www.arrow.com/en/products/ltc2495cuhfpbf/analog-devices?region=europe
R5-R8 R10-R13 = Res0402: Manufacturer_Part_Number: ERA-2AED103X
R9 = Res0402: Manufacturer_Part_Number: TNPW040249K9DEED
RT1-RT5 = TMP6131DECR: Integrated Circuit; Manufacturer_Name: Texas Instruments; Datasheet Link: http://www.ti.com/lit/gpn/TMP61; Height: 0.5mm; Manufacturer_Part_Number: TMP6131DECR; Mouser Part Number: 595-TMP6131DECR; Mouser Price/Stock: https://www.mouser.co.uk/ProductDetail/Texas-Instruments/TMP6131DECR?qs=l7cgNqFNU1jnXQehRCOLwA%3D%3D; Arrow Part Number: TMP6131DECR; Arrow Price/Stock: https://www.arrow.com/en/products/tmp6131decr/texas-instruments?region=nac
Y1 = ECS-2520MVLC-010-CN-TR: Crystal or Oscillator; Manufacturer_Name: ECS; Datasheet Link: https://ecsxtal.com/store/pdf/ECS-2520MVLC.pdf; Height: 0.9mm; Manufacturer_Part_Number: ECS-2520MVLC-010-CN-TR; Mouser Part Number: 520-2520MVLC-010CNTR; Mouser Price/Stock: https://www.mouser.co.uk/ProductDetail/ECS/ECS-2520MVLC-010-CN-TR?qs=vvQtp7zwQdMouzumdpJOhQ%3D%3D
C3 C4 C10 = Cap0402: Voltage: DNI
C8 = Cap0603: Voltage: DNI

## Sheet ToF_Bottom.SchDoc
size A4; SheetNumber: 2; SheetTotal: 10
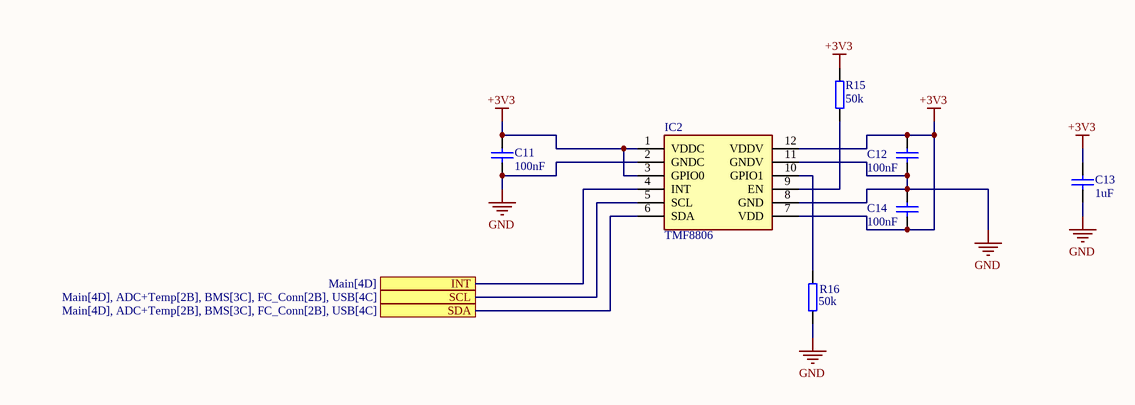
[diagram p5: ToF_Bottom.SchDoc]

### Parts
C11  value 100nF  [CAP0402]  (hidden comment: Cap0402)
C12  value 100nF  [CAP0402]  (hidden comment: Cap0402)
C13  value 1uF  [CAP0603]  (hidden comment: Cap0603)
C14  value 100nF  [CAP0402]  (hidden comment: Cap0402)
IC2  TMF8806  [TMF88051B]
R15  value 50k  [RES0402]  (hidden comment: Res0402)
R16  value 50k  [RES0402]  (hidden comment: Res0402)

### Ports
INT (see Main[4D]), SCL (see Main[4D], ADC+Temp[2B], BMS[3C], FC_Conn[2B], USB[4C]), SDA (see Main[4D], ADC+Temp[2B], BMS[3C], FC_Conn[2B], USB[4C])

### Nets
+3V3: C11.2 C12.2 C13.2 C14.1 IC2.1(VDDC) IC2.3(GPIO0) IC2.7(VDD) IC2.12(VDDV) R15.2
GND: C11.1 C12.1 C13.1 C14.2 IC2.2(GNDC) IC2.8(GND) IC2.11(GNDV) R16.1
SCL: IC2.5(SCL) ; port SCL
SDA: IC2.6(SDA) ; port SDA
TOF_INT: IC2.4(INT) ; port INT
NetIC2_9: IC2.9(EN) R15.1
NetIC2_10: IC2.10(GPIO1) R16.2

### Library data of the parts
C11 C12 C14 = Cap0402: as C39 on sheet BMS
C13 = Cap0603: Manufacturer_Part_Number: GRT188R61H105KE13D; Voltage: 25V
IC2 = TMF8805-1B: Integrated Circuit; Manufacturer_Name: ams OSRAM; Datasheet Link: https://ams.com/documents/20143/4372629/TMF8805_DS000692_4-00.pdf; Height: 1.1mm; Manufacturer_Part_Number: TMF8805-1B; Mouser Part Number: 985-TMF8805-1B; Mouser Price/Stock: https://www.mouser.co.uk/ProductDetail/ams-OSRAM/TMF8805-1B?qs=sPbYRqrBIVlwsjHE%2F%252BrL9g%3D%3D
R15 R16 = Res0402: as R9 on sheet ADC+Temp

## Sheet FC_Conn.SchDoc
size A3; SheetNumber: 6; SheetTotal: 10
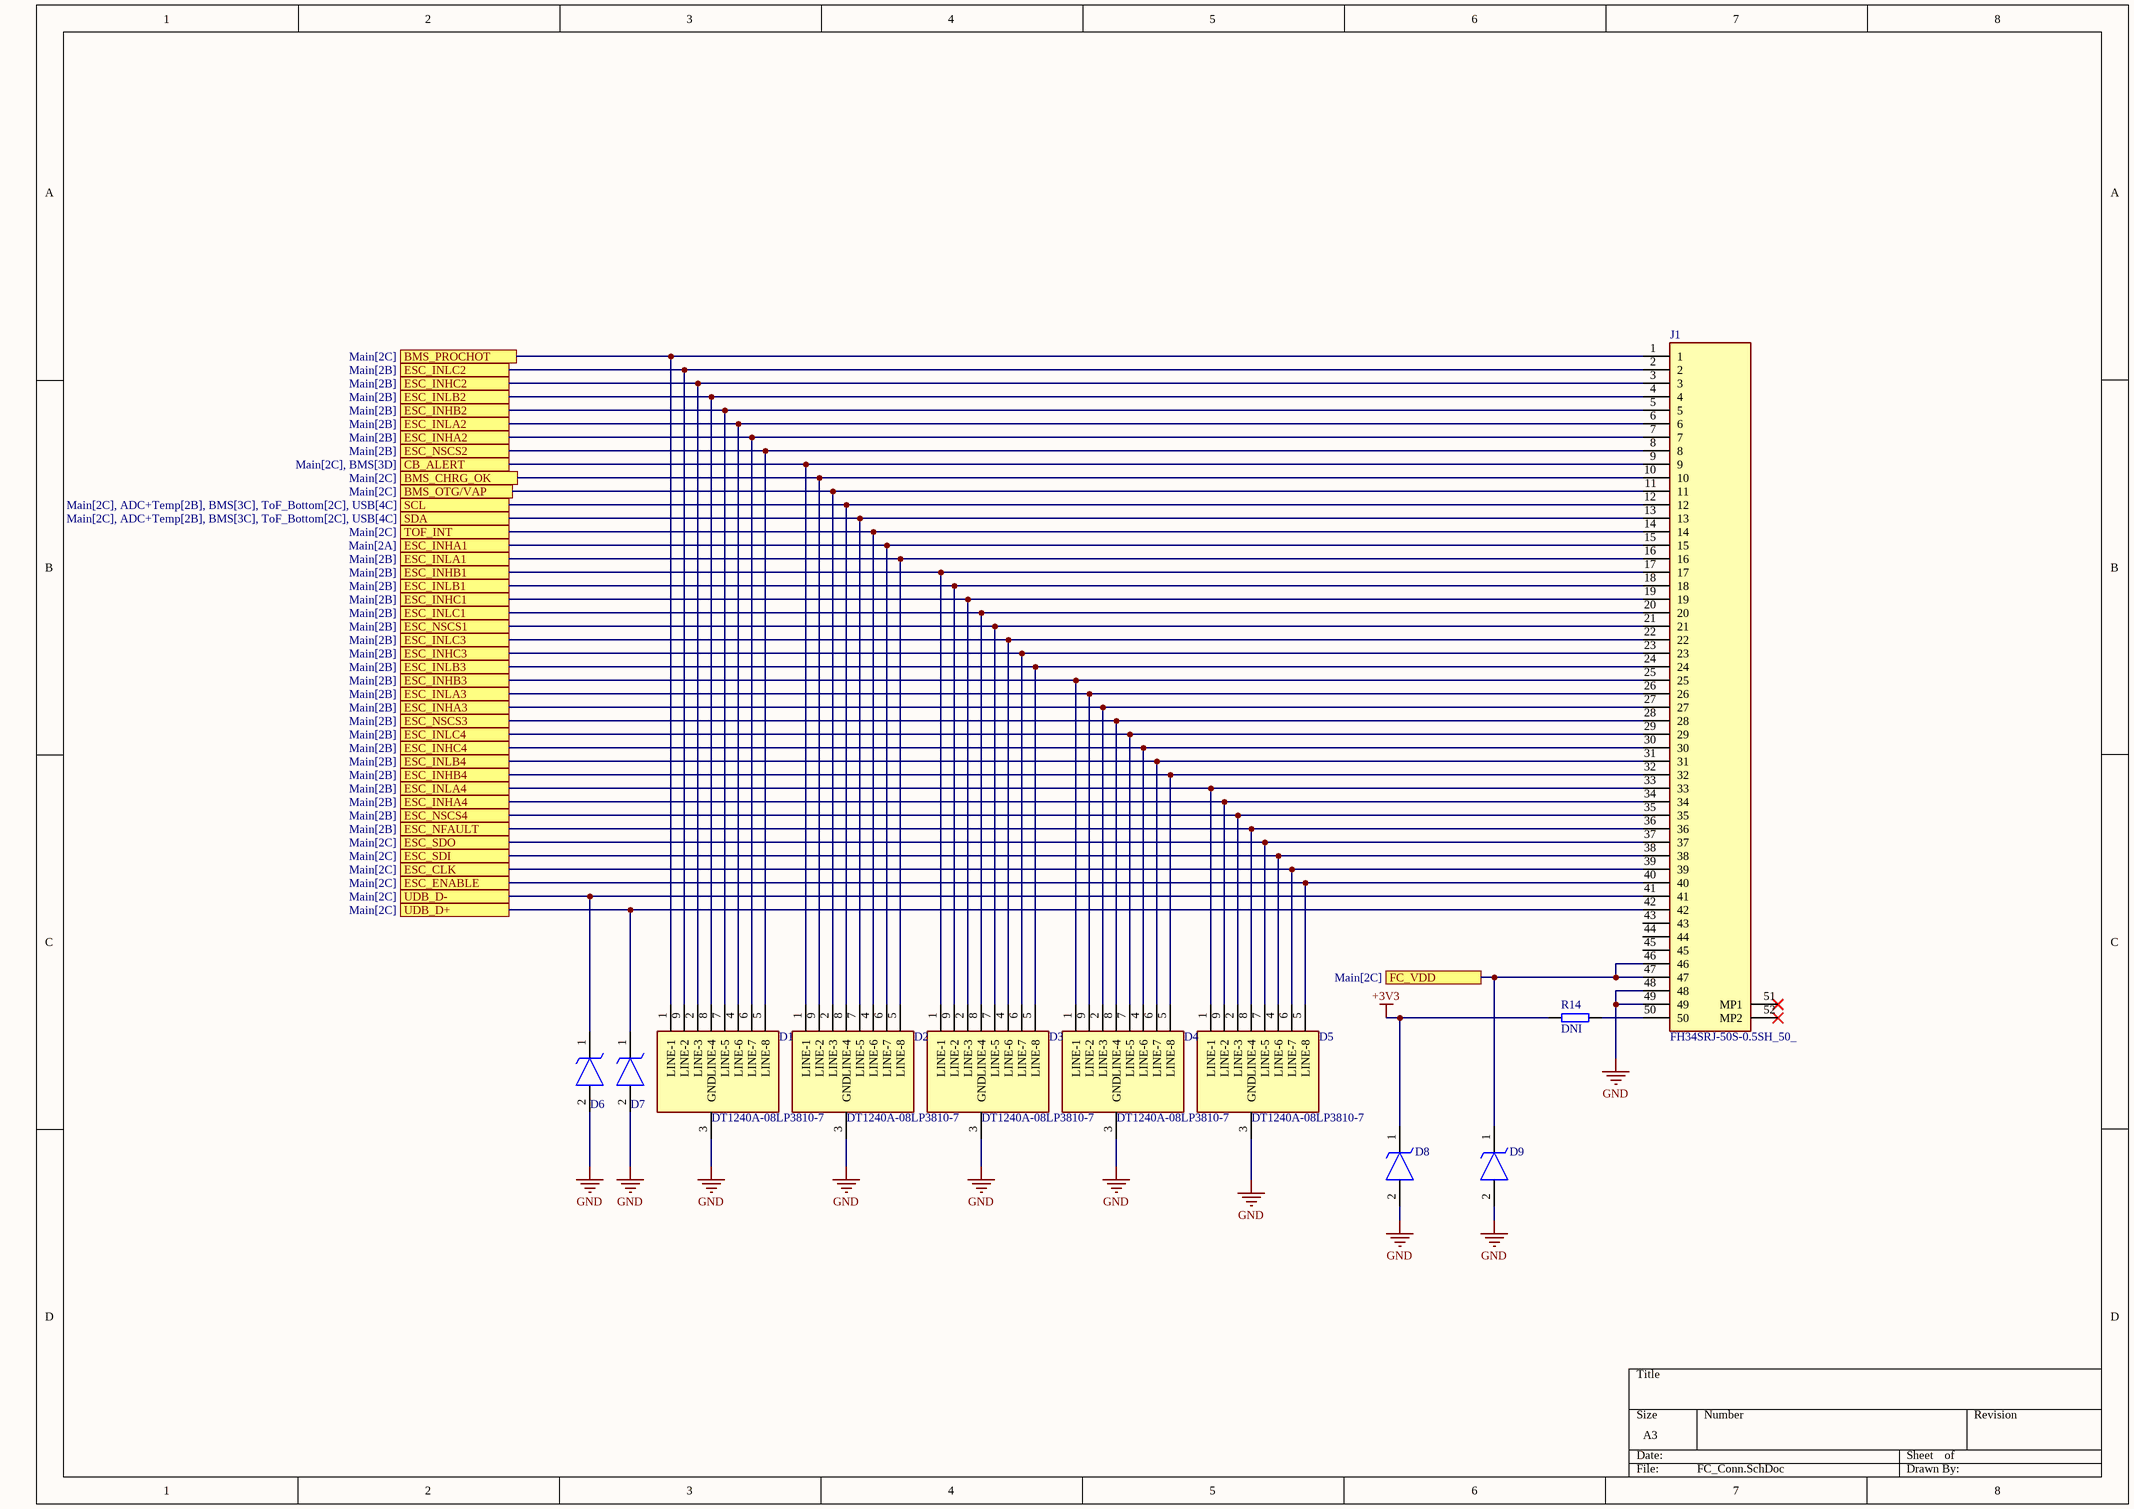
[diagram p6: FC_Conn.SchDoc]

### Parts
D1  DT1240A-08LP3810-7  [DT1240A08LP38107]
D2  DT1240A-08LP3810-7  [DT1240A08LP38107]
D3  DT1240A-08LP3810-7  [DT1240A08LP38107]
D4  DT1240A-08LP3810-7  [DT1240A08LP38107]
D5  DT1240A-08LP3810-7  [DT1240A08LP38107]
D6  D1213A-01LP4-7B  [D1213A01LP47B]  (value not drawn)
D7  D1213A-01LP4-7B  [D1213A01LP47B]  (value not drawn)
D8  DF2S24FS,L3M  [SODFL1006X45N]  (value not drawn)
D9  DF2S24FS,L3M  [SODFL1006X45N]  (value not drawn)
J1  FH34SRJ-50S-0.5SH_50_  [FH34SRJ50S05SH50]
R14  value DNI  [RES0402]  (hidden comment: Res0402)

### Ports
BMS_CHRG_OK (see Main[2C]), BMS_OTG/VAP (see Main[2C]), BMS_PROCHOT (see Main[2C]), CB_ALERT (see Main[2C], BMS[3D]), ESC_CLK (see Main[2C]), ESC_ENABLE (see Main[2C]), ESC_INHA1 (see Main[2A]), ESC_INHA2 (see Main[2B]), ESC_INHA3 (see Main[2B]), ESC_INHA4 (see Main[2B]), ESC_INHB1 (see Main[2B]), ESC_INHB2 (see Main[2B]), ESC_INHB3 (see Main[2B]), ESC_INHB4 (see Main[2B]), ESC_INHC1 (see Main[2B]), ESC_INHC2 (see Main[2B]), ESC_INHC3 (see Main[2B]), ESC_INHC4 (see Main[2B]), ESC_INLA1 (see Main[2B]), ESC_INLA2 (see Main[2B]), ESC_INLA3 (see Main[2B]), ESC_INLA4 (see Main[2B]), ESC_INLB1 (see Main[2B]), ESC_INLB2 (see Main[2B]), ESC_INLB3 (see Main[2B]), ESC_INLB4 (see Main[2B]), ESC_INLC1 (see Main[2B]), ESC_INLC2 (see Main[2B]), ESC_INLC3 (see Main[2B]), ESC_INLC4 (see Main[2B]), ESC_NFAULT (see Main[2B]), ESC_NSCS1 (see Main[2B]), ESC_NSCS2 (see Main[2B]), ESC_NSCS3 (see Main[2B]), ESC_NSCS4 (see Main[2B]), ESC_SDI (see Main[2C]), ESC_SDO (see Main[2C]), FC_VDD (see Main[2C]), SCL (see Main[2C], ADC+Temp[2B], BMS[3C], ToF_Bottom[2C], USB[4C]), SDA (see Main[2C], ADC+Temp[2B], BMS[3C], ToF_Bottom[2C], USB[4C]), TOF_INT (see Main[2C]), UDB_D+ (see Main[2C]), UDB_D- (see Main[2C])

### Nets
+3V3: D8.1(K) R14.2
GND: D1.3(GND) D2.3(GND) D3.3(GND) D4.3(GND) D5.3(GND) D6.2(A) D7.2(A) D8.2(A) D9.2(A) J1.48 J1.49
BMS_CHRG_OK: D2.9(LINE-2) J1.10 ; port BMS_CHRG_OK
BMS_OTG/VAP: D2.2(LINE-3) J1.11 ; port BMS_OTG/VAP
BMS_PROCHOT: D1.1(LINE-1) J1.1 ; port BMS_PROCHOT
CB_ALERT: D2.1(LINE-1) J1.9 ; port CB_ALERT
D_N: D6.1(K) J1.41 ; port UDB_D-
D_P: D7.1(K) J1.42 ; port UDB_D+
ESC_CLK: D5.6(LINE-7) J1.39 ; port ESC_CLK
ESC_ENABLE: D5.5(LINE-8) J1.40 ; port ESC_ENABLE
ESC_INHA_A: D2.6(LINE-7) J1.15 ; port ESC_INHA1
ESC_INHA_B: D1.6(LINE-7) J1.7 ; port ESC_INHA2
ESC_INHA_C: D4.2(LINE-3) J1.27 ; port ESC_INHA3
ESC_INHA_D: D5.9(LINE-2) J1.34 ; port ESC_INHA4
ESC_INHB_A: D3.1(LINE-1) J1.17 ; port ESC_INHB1
ESC_INHB_B: D1.7(LINE-5) J1.5 ; port ESC_INHB2
ESC_INHB_C: D4.1(LINE-1) J1.25 ; port ESC_INHB3
ESC_INHB_D: D4.5(LINE-8) J1.32 ; port ESC_INHB4
ESC_INHC_A: D3.2(LINE-3) J1.19 ; port ESC_INHC1
ESC_INHC_B: D1.2(LINE-3) J1.3 ; port ESC_INHC2
ESC_INHC_C: D3.6(LINE-7) J1.23 ; port ESC_INHC3
ESC_INHC_D: D4.4(LINE-6) J1.30 ; port ESC_INHC4
ESC_INLA_A: D2.5(LINE-8) J1.16 ; port ESC_INLA1
ESC_INLA_B: D1.4(LINE-6) J1.6 ; port ESC_INLA2
ESC_INLA_C: D4.9(LINE-2) J1.26 ; port ESC_INLA3
ESC_INLA_D: D5.1(LINE-1) J1.33 ; port ESC_INLA4
ESC_INLB_A: D3.9(LINE-2) J1.18 ; port ESC_INLB1
ESC_INLB_B: D1.8(LINE-4) J1.4 ; port ESC_INLB2
ESC_INLB_C: D3.5(LINE-8) J1.24 ; port ESC_INLB3
ESC_INLB_D: D4.6(LINE-7) J1.31 ; port ESC_INLB4
ESC_INLC_A: D3.8(LINE-4) J1.20 ; port ESC_INLC1
ESC_INLC_B: D1.9(LINE-2) J1.2 ; port ESC_INLC2
ESC_INLC_C: D3.4(LINE-6) J1.22 ; port ESC_INLC3
ESC_INLC_D: D4.7(LINE-5) J1.29 ; port ESC_INLC4
ESC_NFAULT: D5.8(LINE-4) J1.36 ; port ESC_NFAULT
ESC_NSCS_A: D3.7(LINE-5) J1.21 ; port ESC_NSCS1
ESC_NSCS_B: D1.5(LINE-8) J1.8 ; port ESC_NSCS2
ESC_NSCS_C: D4.8(LINE-4) J1.28 ; port ESC_NSCS3
ESC_NSCS_D: D5.2(LINE-3) J1.35 ; port ESC_NSCS4
ESC_SDI: D5.4(LINE-6) J1.38 ; port ESC_SDI
ESC_SDO: D5.7(LINE-5) J1.37 ; port ESC_SDO
SCL: D2.8(LINE-4) J1.12 ; port SCL
SDA: D2.7(LINE-5) J1.13 ; port SDA
TOF_INT: D2.4(LINE-6) J1.14 ; port TOF_INT
VSYS: D9.1(K) J1.46 J1.47 ; port FC_VDD
NetJ1_50: J1.50 R14.1

Not connected (* = marked no-connect by the designer): J1 43 44 45 51(MP1)* 52(MP2)*

### Notes on the sheet
- Each ESC can output 30mA, PB schould be able to sustain itself

### Library data of the parts
D1-D5 = DT1240A-08LP3810-7: TVS Diode (Uni-directional); Manufacturer_Name: Diodes Incorporated; Datasheet Link: https://www.diodes.com//assets/Datasheets/DT1240A-08LP3810.pdf; Height: 0.55mm; Manufacturer_Part_Number: DT1240A-08LP3810-7; Mouser Part Number: 621-DT1240A08LP38107; Mouser Price/Stock: https://www.mouser.co.uk/ProductDetail/Diodes-Incorporated/DT1240A-08LP3810-7?qs=W0yvOO0ixfFwCalJyqXN4A%3D%3D; Arrow Part Number: DT1240A-08LP3810-7; Arrow Price/Stock: null?region=nac
D6 D7 = D1213A-01LP4-7B: as D10 on sheet USB; Datasheet Link: https://www.diodes.com/assets/Datasheets/D1213A-01LP4.pdf; Height: 0.4mm; Manufacturer_Part_Number: D1213A-01LP4-7B; Mouser Part Number: 621-D1213A-01LP4-7B; Mouser Price/Stock: https://www.mouser.co.uk/ProductDetail/Diodes-Incorporated/D1213A-01LP4-7B?qs=gfe7vQ8txpVKfG5NOSOvfA%3D%3D; Arrow Part Number: D1213A-01LP4-7B; Arrow Price/Stock: https://www.arrow.com/en/products/d1213a-01lp4-7b/diodes-incorporated?region=europe
D8 D9 = DF2S24FS,L3M: as D12 on sheet USB; Datasheet Link: https://www.mouser.com/datasheet/2/408/DF2S24FS_datasheet_en_20140718-708374.pdf; Height: 0.45mm; Manufacturer_Part_Number: DF2S24FS,L3M; Mouser Part Number: 757-DF2S24FSL3M; Mouser Price/Stock: https://www.mouser.co.uk/ProductDetail/Toshiba/DF2S24FSL3M?qs=lhkzy8lC%252BSvG2umxl0FuEw%3D%3D; Arrow Part Number: DF2S24FS,L3M; Arrow Price/Stock: https://www.arrow.com/en/products/df2s24fsl3m/toshiba?region=nac
J1 = FH34SRJ-50S-0.5SH_50_: Connector; Manufacturer_Name: Hirose; Manufacturer_Part_Number: FH34SRJ-50S-0.5SH(50); Datasheet Link: https://www.hirose.com/en/product/document?clcode=CL0580-1266-2-50&productname=FH34SRJ-50S-0.5SH(50)&series=FH34SRJ&documenttype=2DDrawing&lang=en&documentid=0001483059; Height: 1.75mm; Mouser Part Number: 798-FH34SRJ50S05SH50; Mouser Price/Stock: https://www.mouser.co.uk/ProductDetail/Hirose-Connector/FH34SRJ-50S-0.5SH50?qs=vcbW%252B4%252BSTIrLLD%2F8H%2F%252B%2Fhg%3D%3D; System: Connector

## Sheet ESC_A.SchDoc
size A3; SheetNumber: 7; SheetTotal: 10
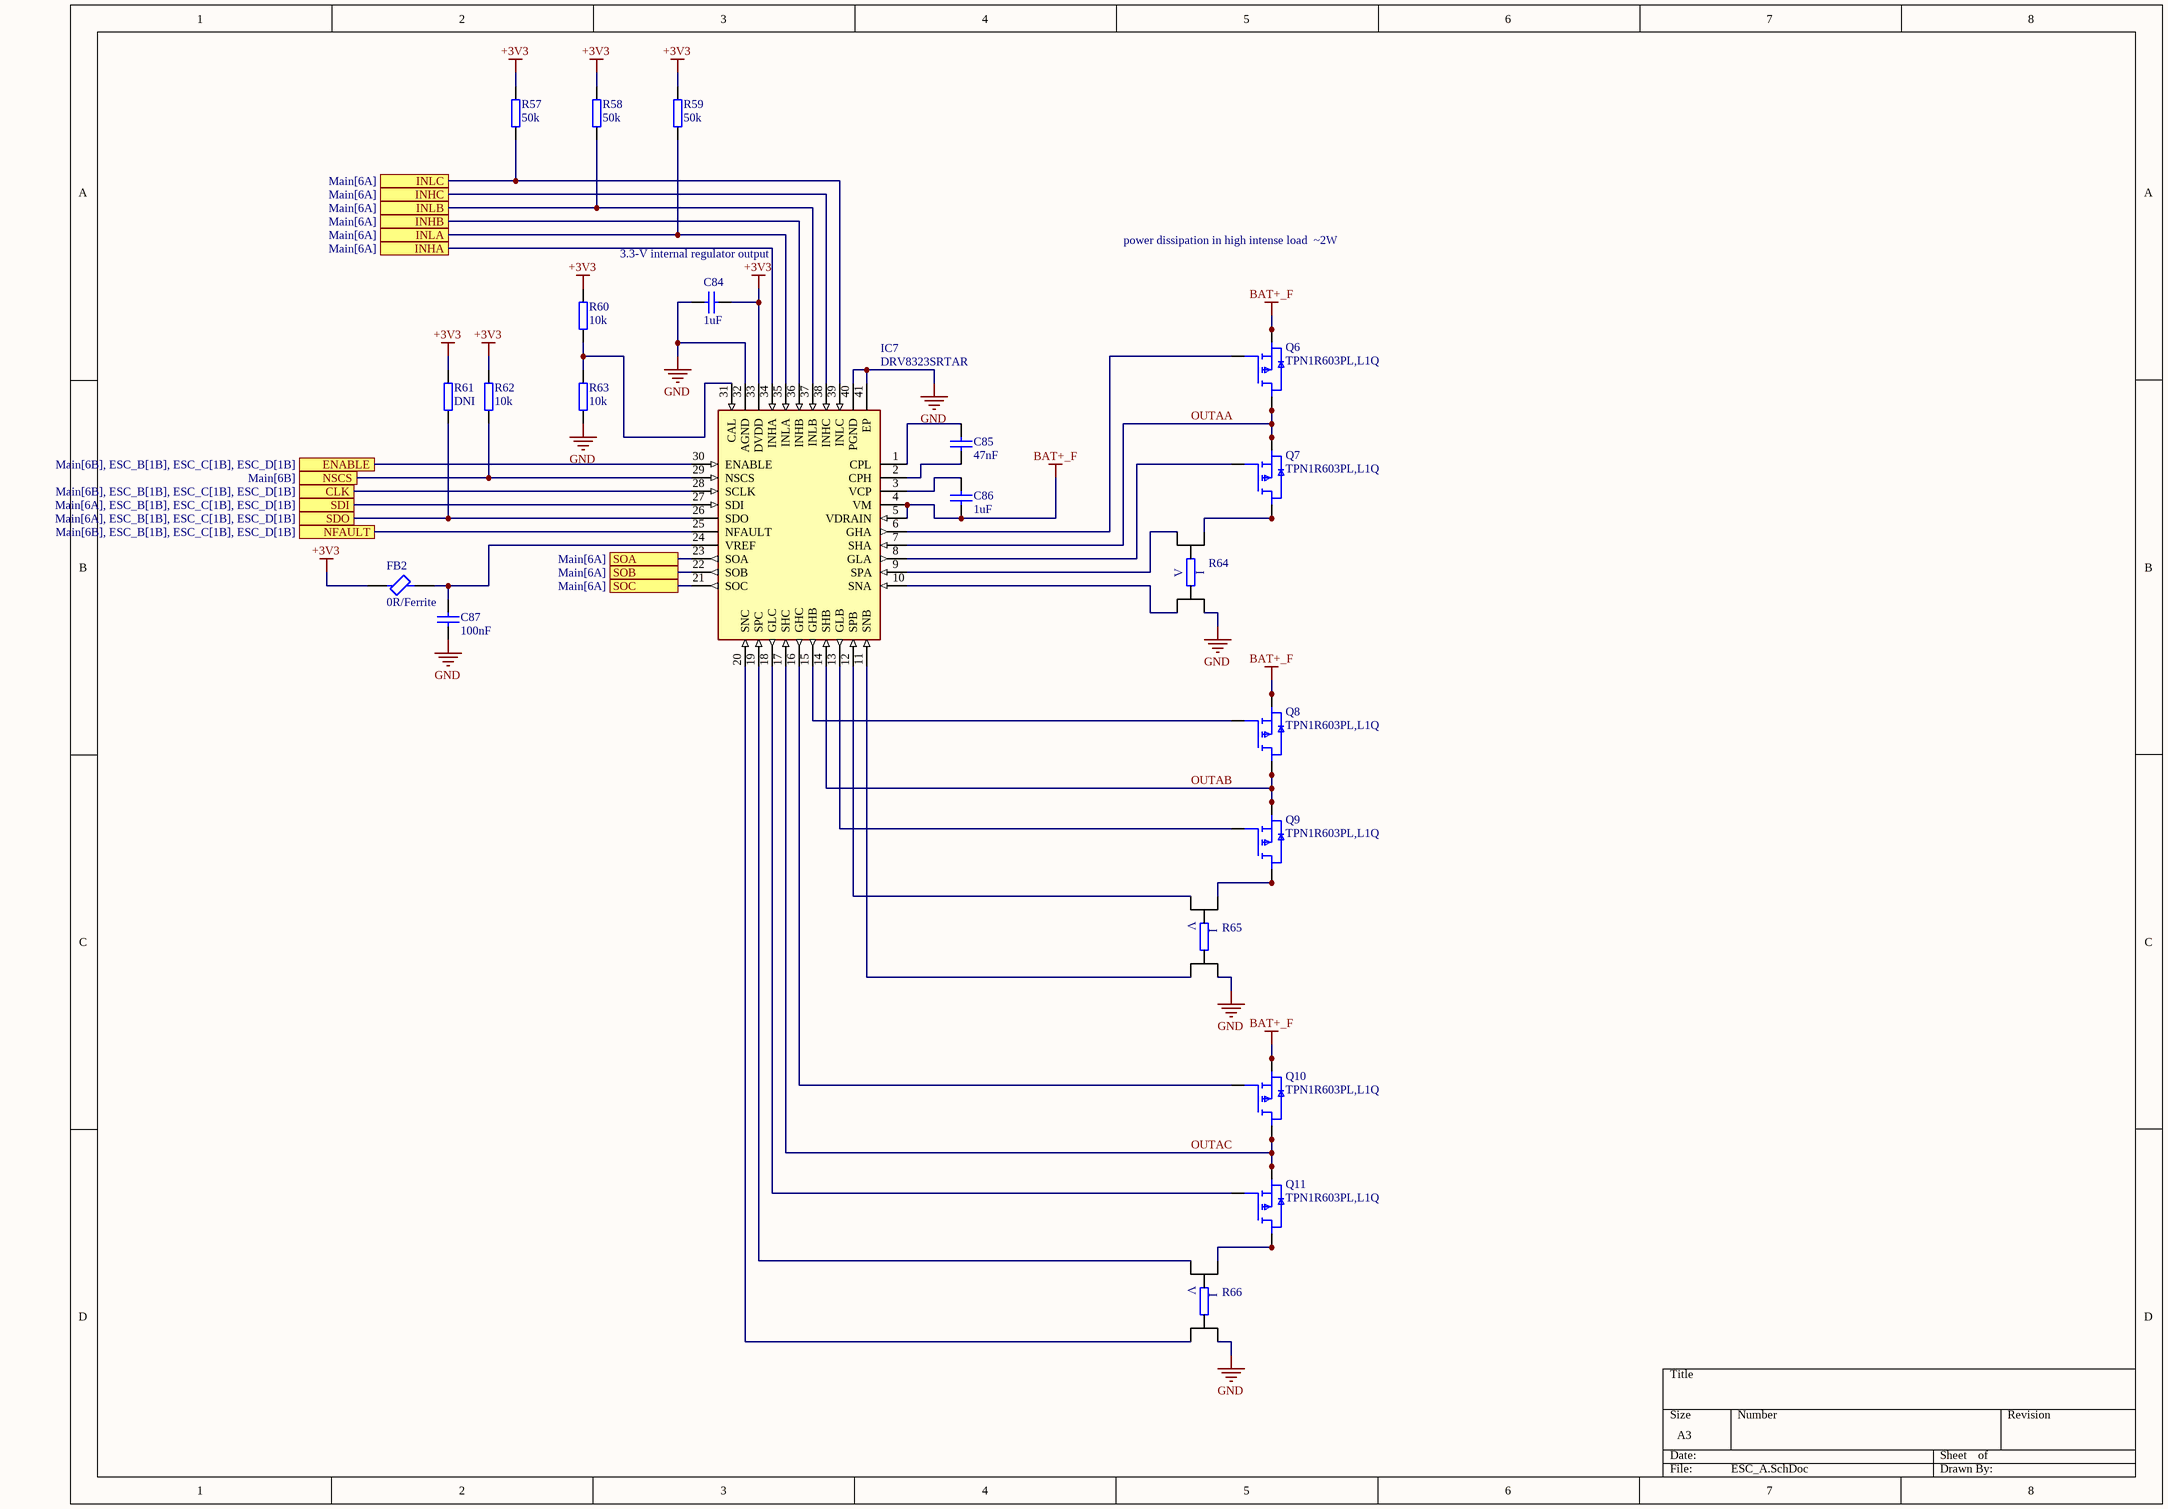
[diagram p7: ESC_A.SchDoc]

### Parts
C84  value 1uF  [CAP0402]  (hidden comment: Cap0402)
C85  value 47nF  [CAP0603]  (hidden comment: Cap0603)
C86  value 1uF  [CAP0603]  (hidden comment: Cap0603)
C87  value 100nF  [CAP0402]  (hidden comment: Cap0402)
FB2  0R/Ferrite  [NFZ15SG152SN10B]
IC7  DRV8323SRTAR  [QFN50P600X600X80-41N-D]
Q6  TPN1R603PL,L1Q  [TPN1R603PLL1Q]
Q7  TPN1R603PL,L1Q  [TPN1R603PLL1Q]
Q8  TPN1R603PL,L1Q  [TPN1R603PLL1Q]
Q9  TPN1R603PL,L1Q  [TPN1R603PLL1Q]
Q10  TPN1R603PL,L1Q  [TPN1R603PLL1Q]
Q11  TPN1R603PL,L1Q  [TPN1R603PLL1Q]
R57  value 50k  [RES0402]  (hidden comment: Res0402)
R58  value 50k  [RES0402]  (hidden comment: Res0402)
R59  value 50k  [RES0402]  (hidden comment: Res0402)
R60  value 10k  [RES0402]  (hidden comment: Res0402)
R61  value DNI  [RES0402]  (hidden comment: Res0402)
R62  value 10k  [RES0402]  (hidden comment: Res0402)
R63  value 10k  [RES0402]  (hidden comment: Res0402)
R64  WSK12161L000FEA  [WSK12161L000FEA]  (value not drawn)
R65  WSK12161L000FEA  [WSK12161L000FEA]  (value not drawn)
R66  WSK12161L000FEA  [WSK12161L000FEA]  (value not drawn)

### Ports
CLK (see Main[6B], ESC_B[1B], ESC_C[1B], ESC_D[1B]), ENABLE (see Main[6B], ESC_B[1B], ESC_C[1B], ESC_D[1B]), INHA (see Main[6A]), INHB (see Main[6A]), INHC (see Main[6A]), INLA (see Main[6A]), INLB (see Main[6A]), INLC (see Main[6A]), NFAULT (see Main[6B], ESC_B[1B], ESC_C[1B], ESC_D[1B]), NSCS (see Main[6B]), SDI (see Main[6A], ESC_B[1B], ESC_C[1B], ESC_D[1B]), SDO (see Main[6A], ESC_B[1B], ESC_C[1B], ESC_D[1B]), SOA (see Main[6A]), SOB (see Main[6A]), SOC (see Main[6A])

### Nets
+3V3: C84.2 FB2.1 IC7.33(DVDD) R57.2 R58.2 R59.2 R60.2 R61.2 R62.2
BAT+_F: C86.1 IC7.4(VM) IC7.5(VDRAIN) Q6.1(S_1) Q6.2(S_2) Q6.3(S_3) Q8.1(S_1) Q8.2(S_2) Q8.3(S_3) Q10.1(S_1) Q10.2(S_2) Q10.3(S_3)
GND: C84.1 C87.1 IC7.32(AGND) IC7.40(PGND) IC7.41(EP) R63.1 R64.1 R65.4 R66.4
ESC_CLK: IC7.28(SCLK) ; port CLK
ESC_ENABLE: IC7.30(ENABLE) ; port ENABLE
ESC_INHA_A: IC7.34(INHA) ; port INHA
ESC_INHB_A: IC7.36(INHB) ; port INHB
ESC_INHC_A: IC7.38(INHC) ; port INHC
ESC_INLA_A: IC7.35(INLA) R59.1 ; port INLA
ESC_INLB_A: IC7.37(INLB) R58.1 ; port INLB
ESC_INLC_A: IC7.39(INLC) R57.1 ; port INLC
ESC_NFAULT: IC7.25(NFAULT) ; port NFAULT
ESC_NSCS_A: IC7.29(NSCS) R62.1 ; port NSCS
ESC_SDI: IC7.27(SDI) ; port SDI
ESC_SDO: IC7.26(SDO) R61.1 ; port SDO
ESC_SOA_A: IC7.23(SOA) ; port SOA
ESC_SOB_A: IC7.22(SOB) ; port SOB
ESC_SOC_A: IC7.21(SOC) ; port SOC
OUTAA: IC7.7(SHA) Q6.5(D_1) Q6.6(D_2) Q6.7(D_3) Q6.8(D_4) Q6.9(D_4) Q7.1(S_1) Q7.2(S_2) Q7.3(S_3)
OUTAB: IC7.14(SHB) Q8.5(D_1) Q8.6(D_2) Q8.7(D_3) Q8.8(D_4) Q8.9(D_4) Q9.1(S_1) Q9.2(S_2) Q9.3(S_3)
OUTAC: IC7.17(SHC) Q10.5(D_1) Q10.6(D_2) Q10.7(D_3) Q10.8(D_4) Q10.9(D_4) Q11.1(S_1) Q11.2(S_2) Q11.3(S_3)
NetC85_1: C85.1 IC7.2(CPH)
NetC85_2: C85.2 IC7.1(CPL)
NetC86_2: C86.2 IC7.3(VCP)
NetC87_2: C87.2 FB2.2 IC7.24(VREF)
NetIC7_6: IC7.6(GHA) Q6.4(G)
NetIC7_8: IC7.8(GLA) Q7.4(G)
NetIC7_9: IC7.9(SPA) R64.3
NetIC7_10: IC7.10(SNA) R64.2
NetIC7_11: IC7.11(SNB) R65.3
NetIC7_12: IC7.12(SPB) R65.2
NetIC7_13: IC7.13(GLB) Q9.4(G)
NetIC7_15: IC7.15(GHB) Q8.4(G)
NetIC7_16: IC7.16(GHC) Q10.4(G)
NetIC7_18: IC7.18(GLC) Q11.4(G)
NetIC7_19: IC7.19(SPC) R66.2
NetIC7_20: IC7.20(SNC) R66.3
NetIC7_31: IC7.31(CAL) R60.1 R63.2
NetQ7_5: Q7.5(D_1) Q7.6(D_2) Q7.7(D_3) Q7.8(D_4) Q7.9(D_4) R64.4
NetQ9_5: Q9.5(D_1) Q9.6(D_2) Q9.7(D_3) Q9.8(D_4) Q9.9(D_4) R65.1
NetQ11_5: Q11.5(D_1) Q11.6(D_2) Q11.7(D_3) Q11.8(D_4) Q11.9(D_4) R66.1

### Notes on the sheet
- power dissipation in high intense load  ~2W
- 3.3-V internal regulator output
- (near IC7) Separate grounds?
- (in symbol WSK1216L5000FEA) I; V

### Library data of the parts
C84 = Cap0402: as C38 on sheet BMS
C85 C86 = CapSMD0603: 50V; Published: 8-Jun-2000; LatestRevisionDate: 29-May-2009; LatestRevisionNote: IPC-7351 Footprint Added.; PackageReference: C1206; Publisher: Altium Limited; PackageDescription: Chip Capacitor
C87 = Cap0402: as C39 on sheet BMS
FB2 = BLM15PE471SH1D: as FB1 on sheet ADC+Temp; Datasheet Link: https://www.murata.com/en-global/products/productdetail.aspx?cate=luNoiseSupprFilteChipFerriBead&partno=BLM15PE471SH1%23; Height: 0.55mm; Manufacturer_Part_Number: BLM15PE471SH1D; Mouser Part Number: 81-BLM15PE471SH1D; Mouser Price/Stock: https://www.mouser.co.uk/ProductDetail/Murata-Electronics/BLM15PE471SH1D?qs=DRkmTr78QATAY5qAVx1hGA%3D%3D
IC7 = DRV8323SRTAR: Integrated Circuit; Manufacturer_Name: Texas Instruments; Datasheet Link: http://www.ti.com/lit/ds/symlink/drv8323.pdf; Height: 0.8mm; Manufacturer_Part_Number: DRV8323SRTAR; Mouser Part Number: 595-DRV8323SRTAR; Mouser Price/Stock: https://www.mouser.co.uk/ProductDetail/Texas-Instruments/DRV8323SRTAR?qs=u4fy%2FsgLU9P2gpPTX6mffg%3D%3D; Arrow Part Number: DRV8323SRTAR; Arrow Price/Stock: https://www.arrow.com/en/products/drv8323srtar/texas-instruments?utm_currency=USD&region=nac
Q6-Q11 = TPN1R603PL,L1Q: MOSFET (N-Channel); Manufacturer_Name: Toshiba; Datasheet Link: https://toshiba.semicon-storage.com/ap-en/semiconductor/product/mosfets/12v-300v-mosfets/detail.TPN1R603PL.html; Height: 0.9mm; Manufacturer_Part_Number: TPN1R603PL,L1Q; Mouser Part Number: 757-TPN1R603PLL1Q; Mouser Price/Stock: https://www.mouser.co.uk/ProductDetail/Toshiba/TPN1R603PLL1Q?qs=bUPhaerQQeGYpGlYi%252BLguw%3D%3D; Arrow Part Number: TPN1R603PL,L1Q; Arrow Price/Stock: https://www.arrow.com/en/products/tpn1r603pll1q/toshiba?utm_currency=USD&region=nac
R57-R59 = Res0402: as R9 on sheet ADC+Temp
R60 R62 R63 = Res0402: Manufacturer_Part_Number: ERA-2AED103X
R64-R66 = WSK1216L5000FEA: Resistor; Manufacturer_Name: Vishay; Datasheet Link: http://www.vishay.com/docs/30189/wsk1216.pdf; Height: 1.9mm; Manufacturer_Part_Number: WSK1216L5000FEA; Mouser Part Number: 71-WSK1216L5000FEA; Mouser Price/Stock: https://www.mouser.co.uk/ProductDetail/Vishay-Dale/WSK1216L5000FEA?qs=OlC7AqGiEDlM2wGD42LFoQ%3D%3D; Arrow Part Number: WSK1216L5000FEA; Arrow Price/Stock: https://www.arrow.com/en/products/wsk1216l5000fea/vishay?region=nac